# Altium schematic sheet 盲人学习机V6.01.SchDoc (part 1 of 2)
size A0
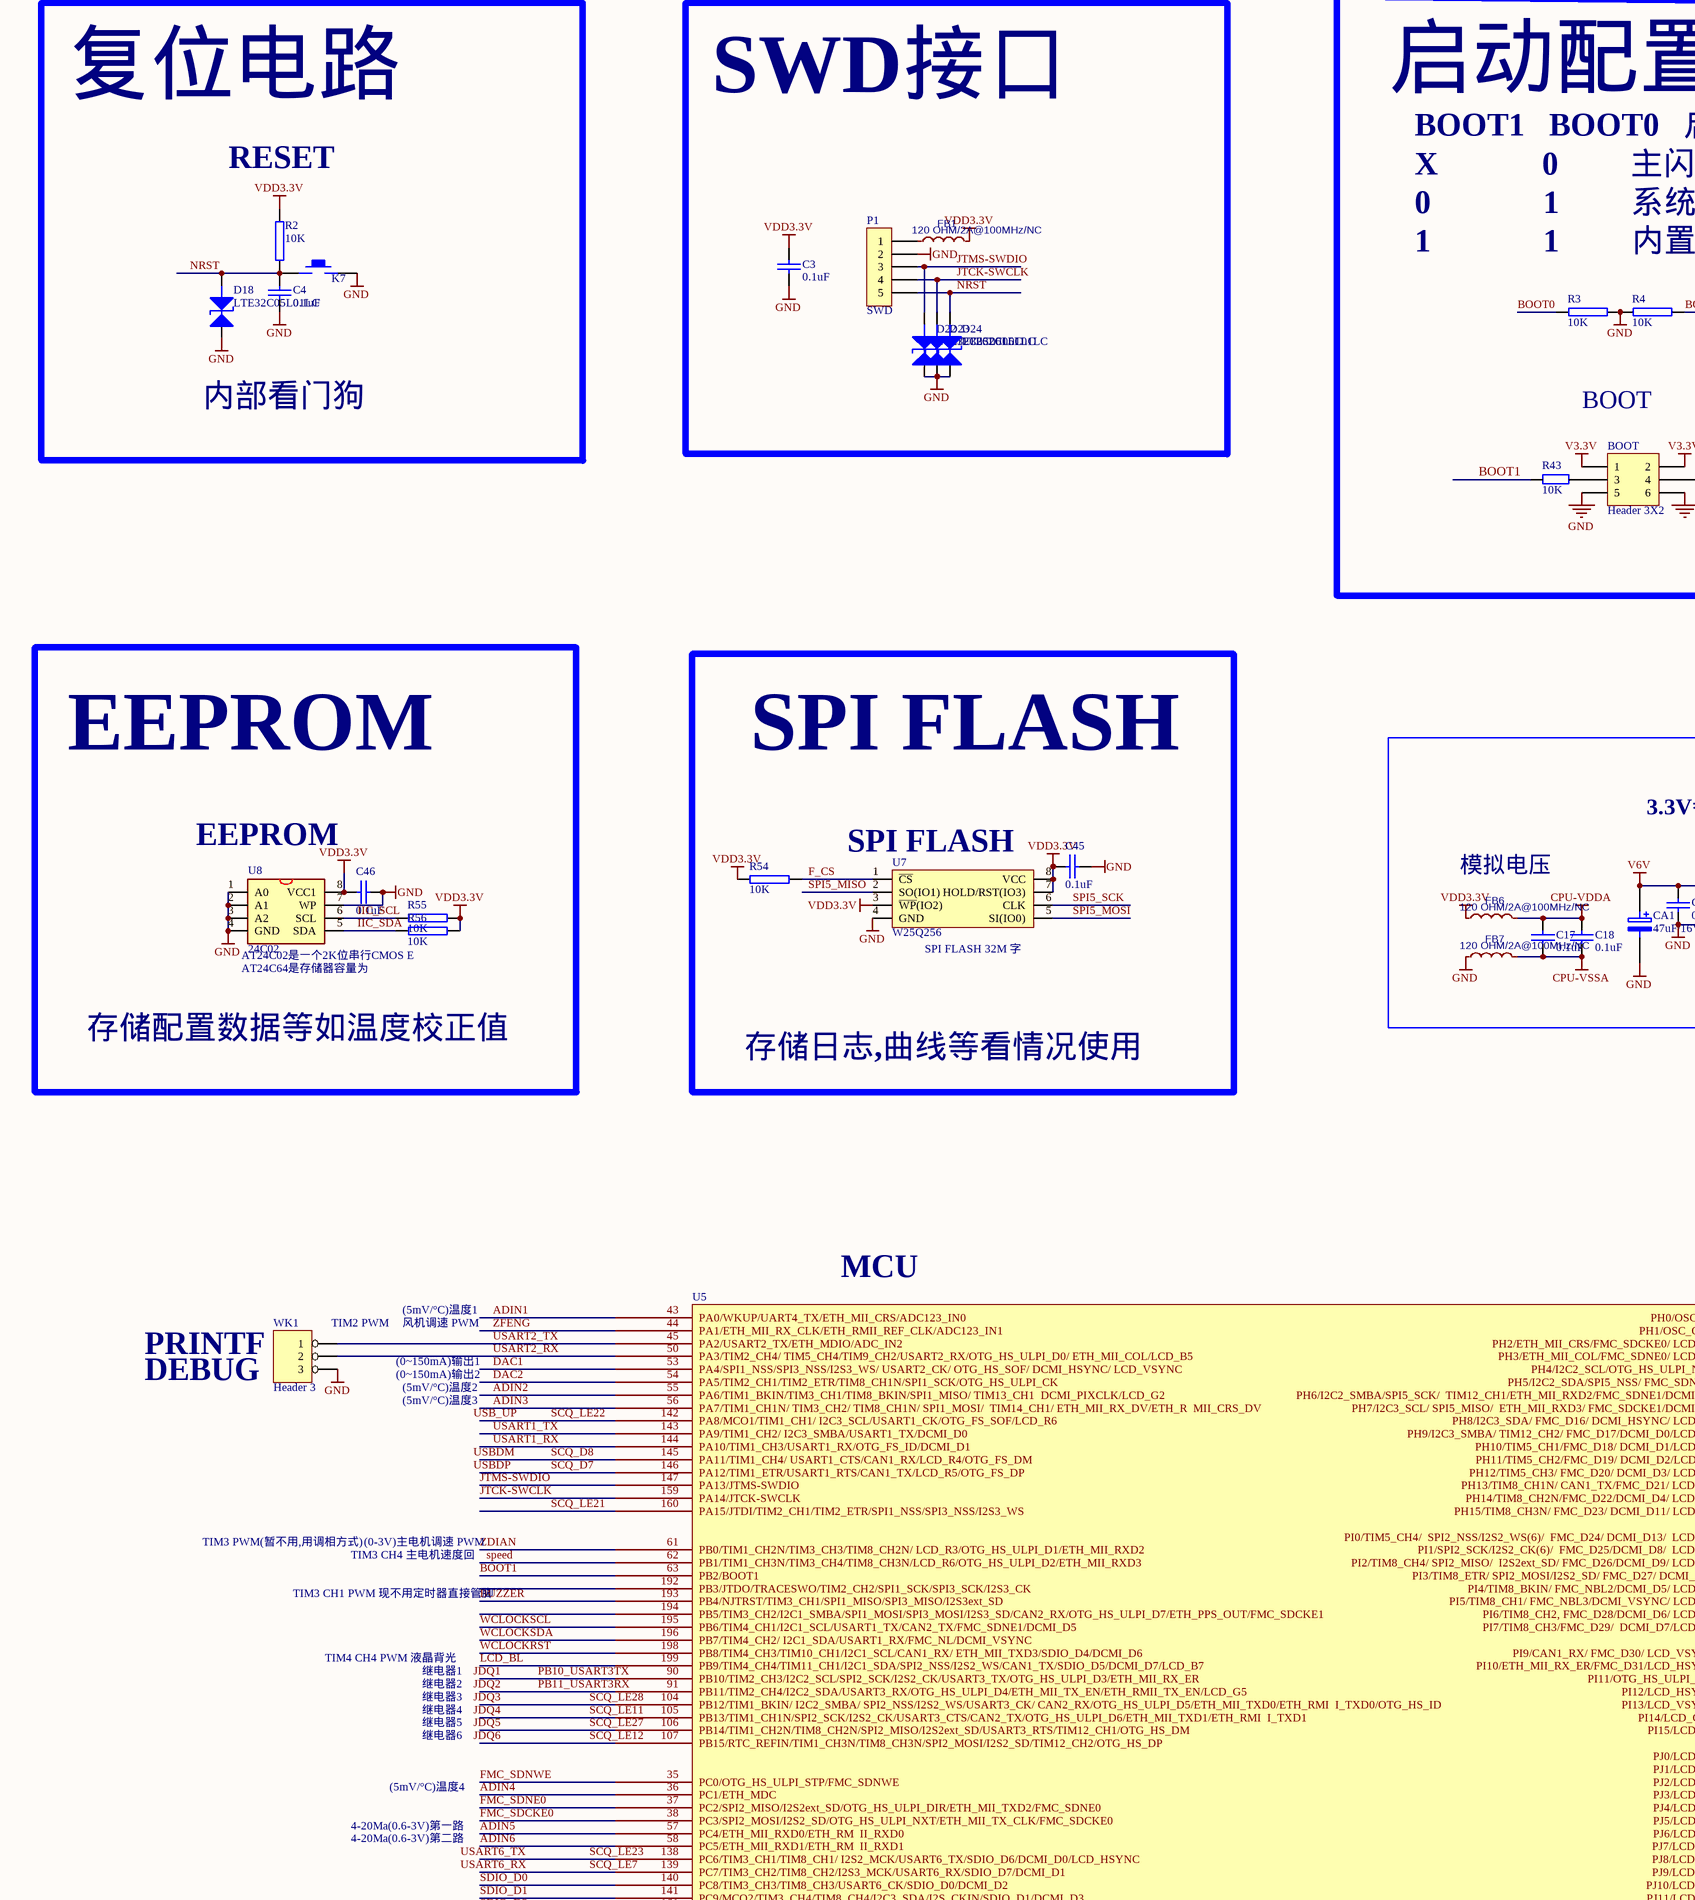
[diagram p0: 盲人学习机V6.01.SchDoc, top left]
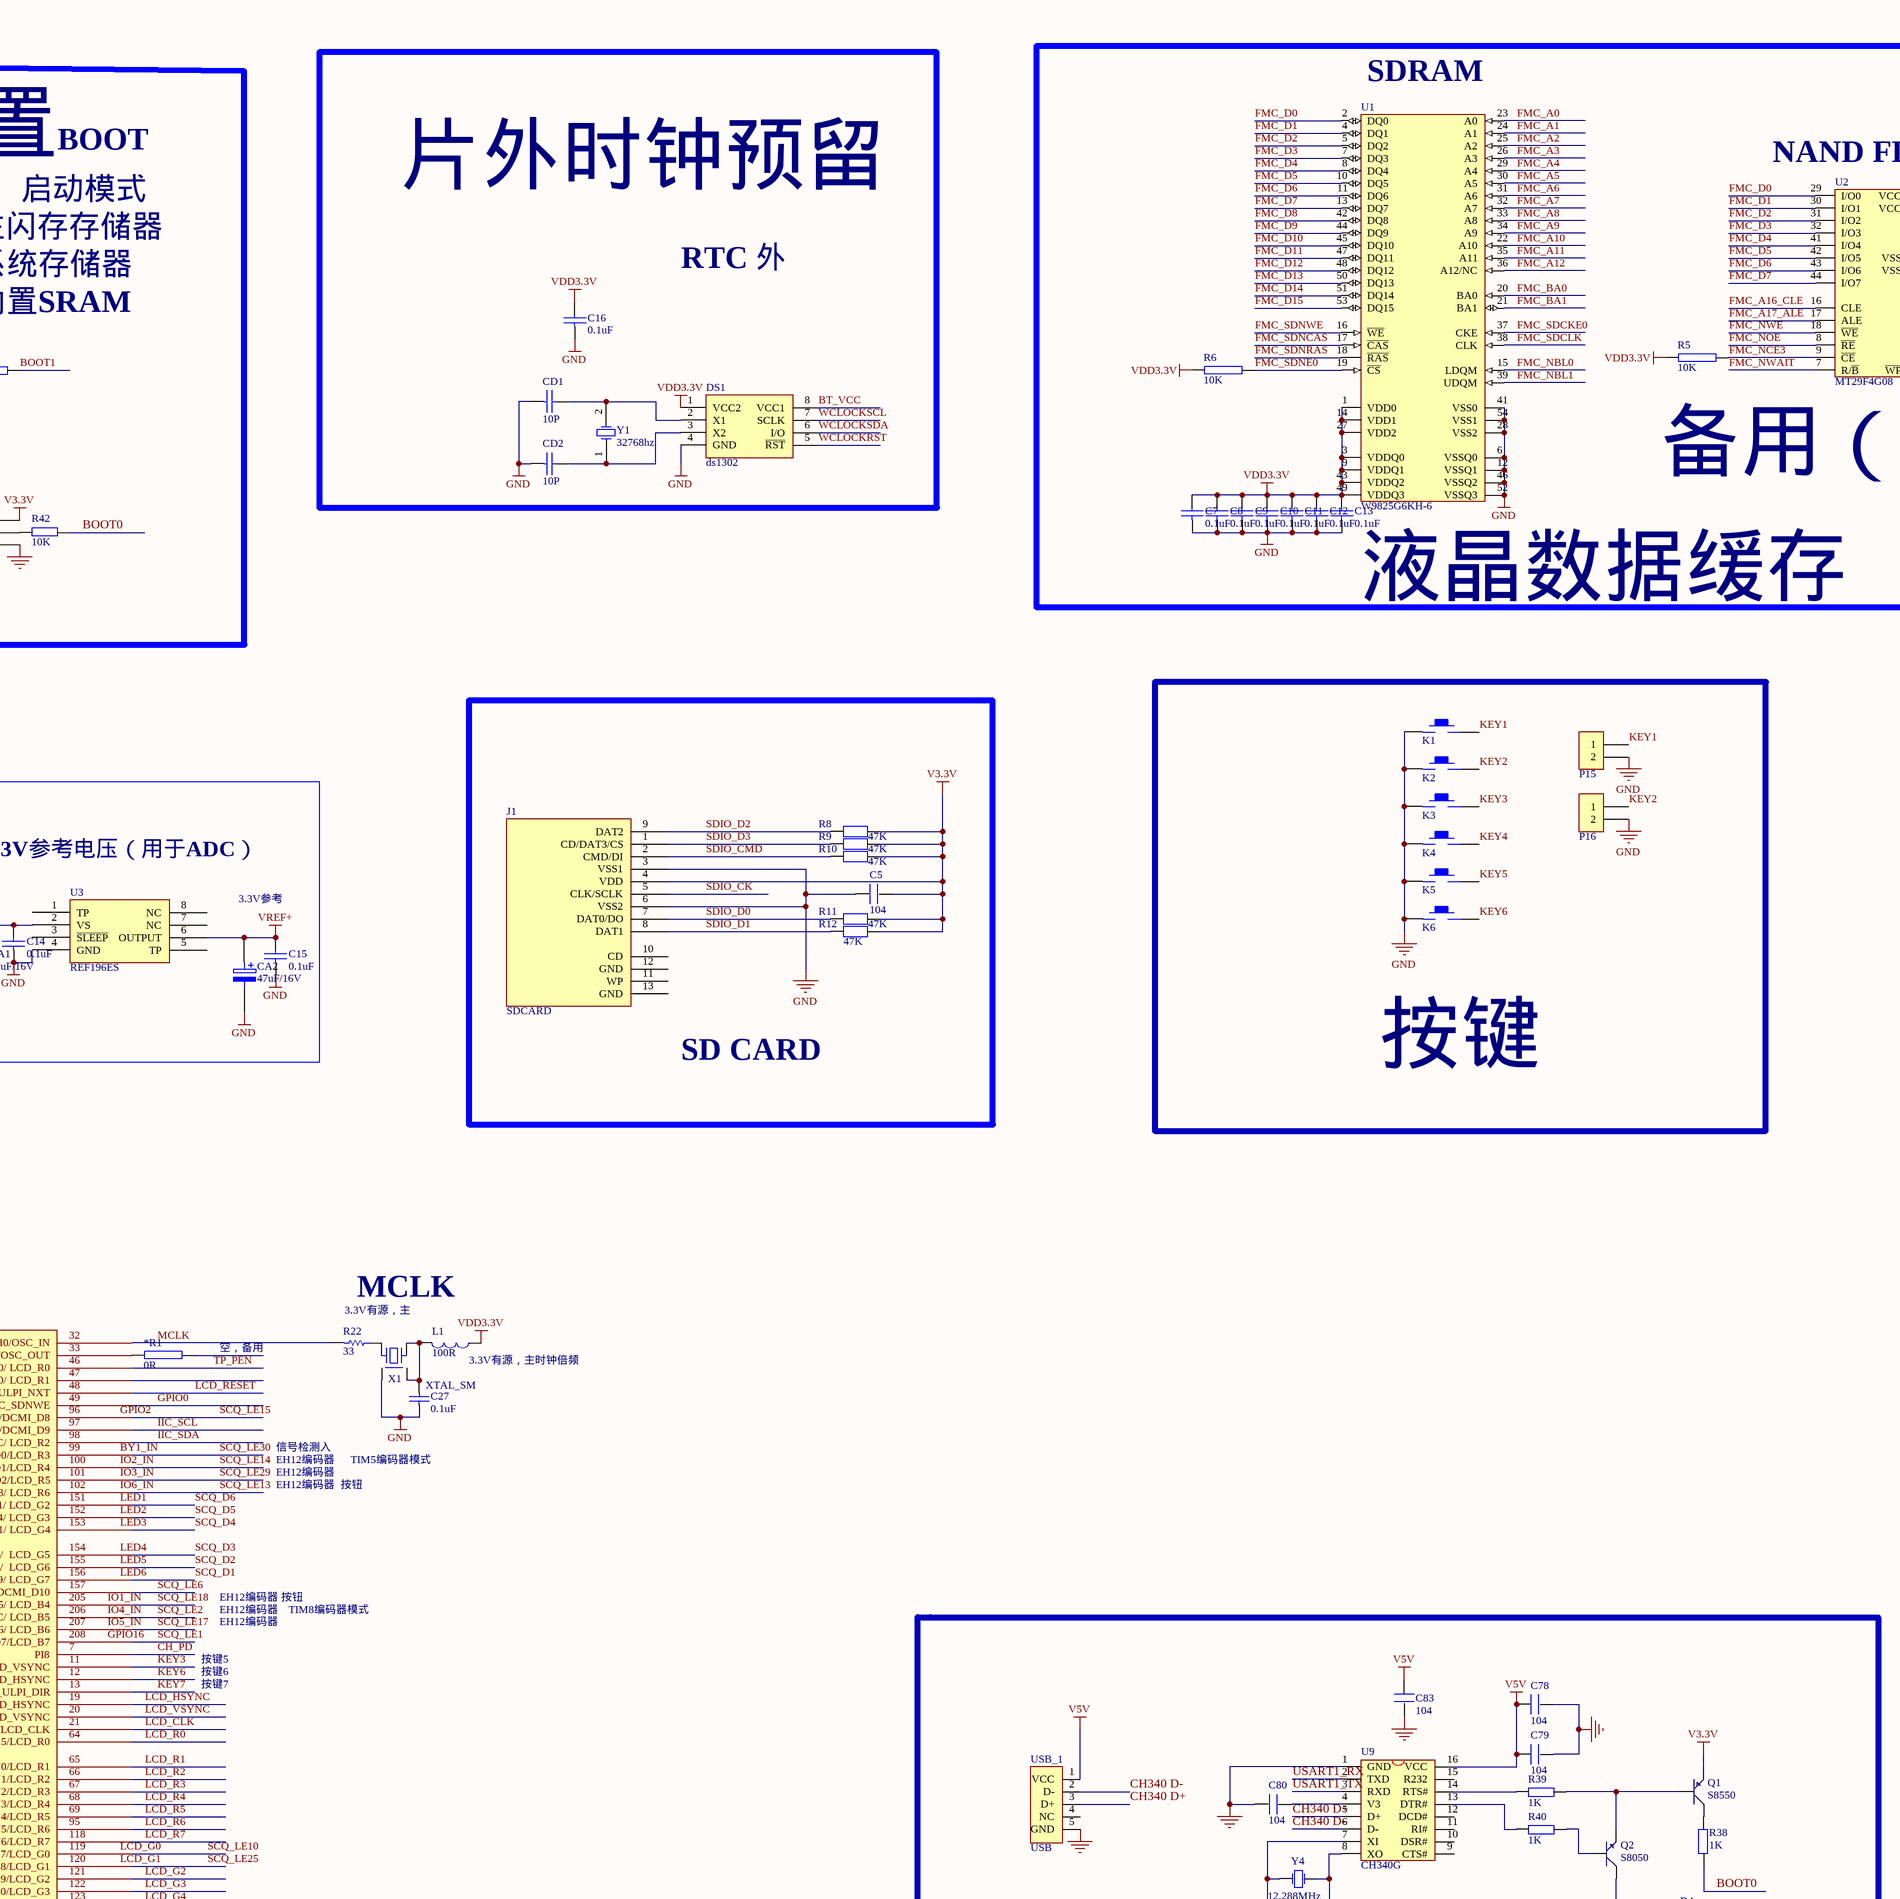
[diagram p1: 盲人学习机V6.01.SchDoc, top middle]
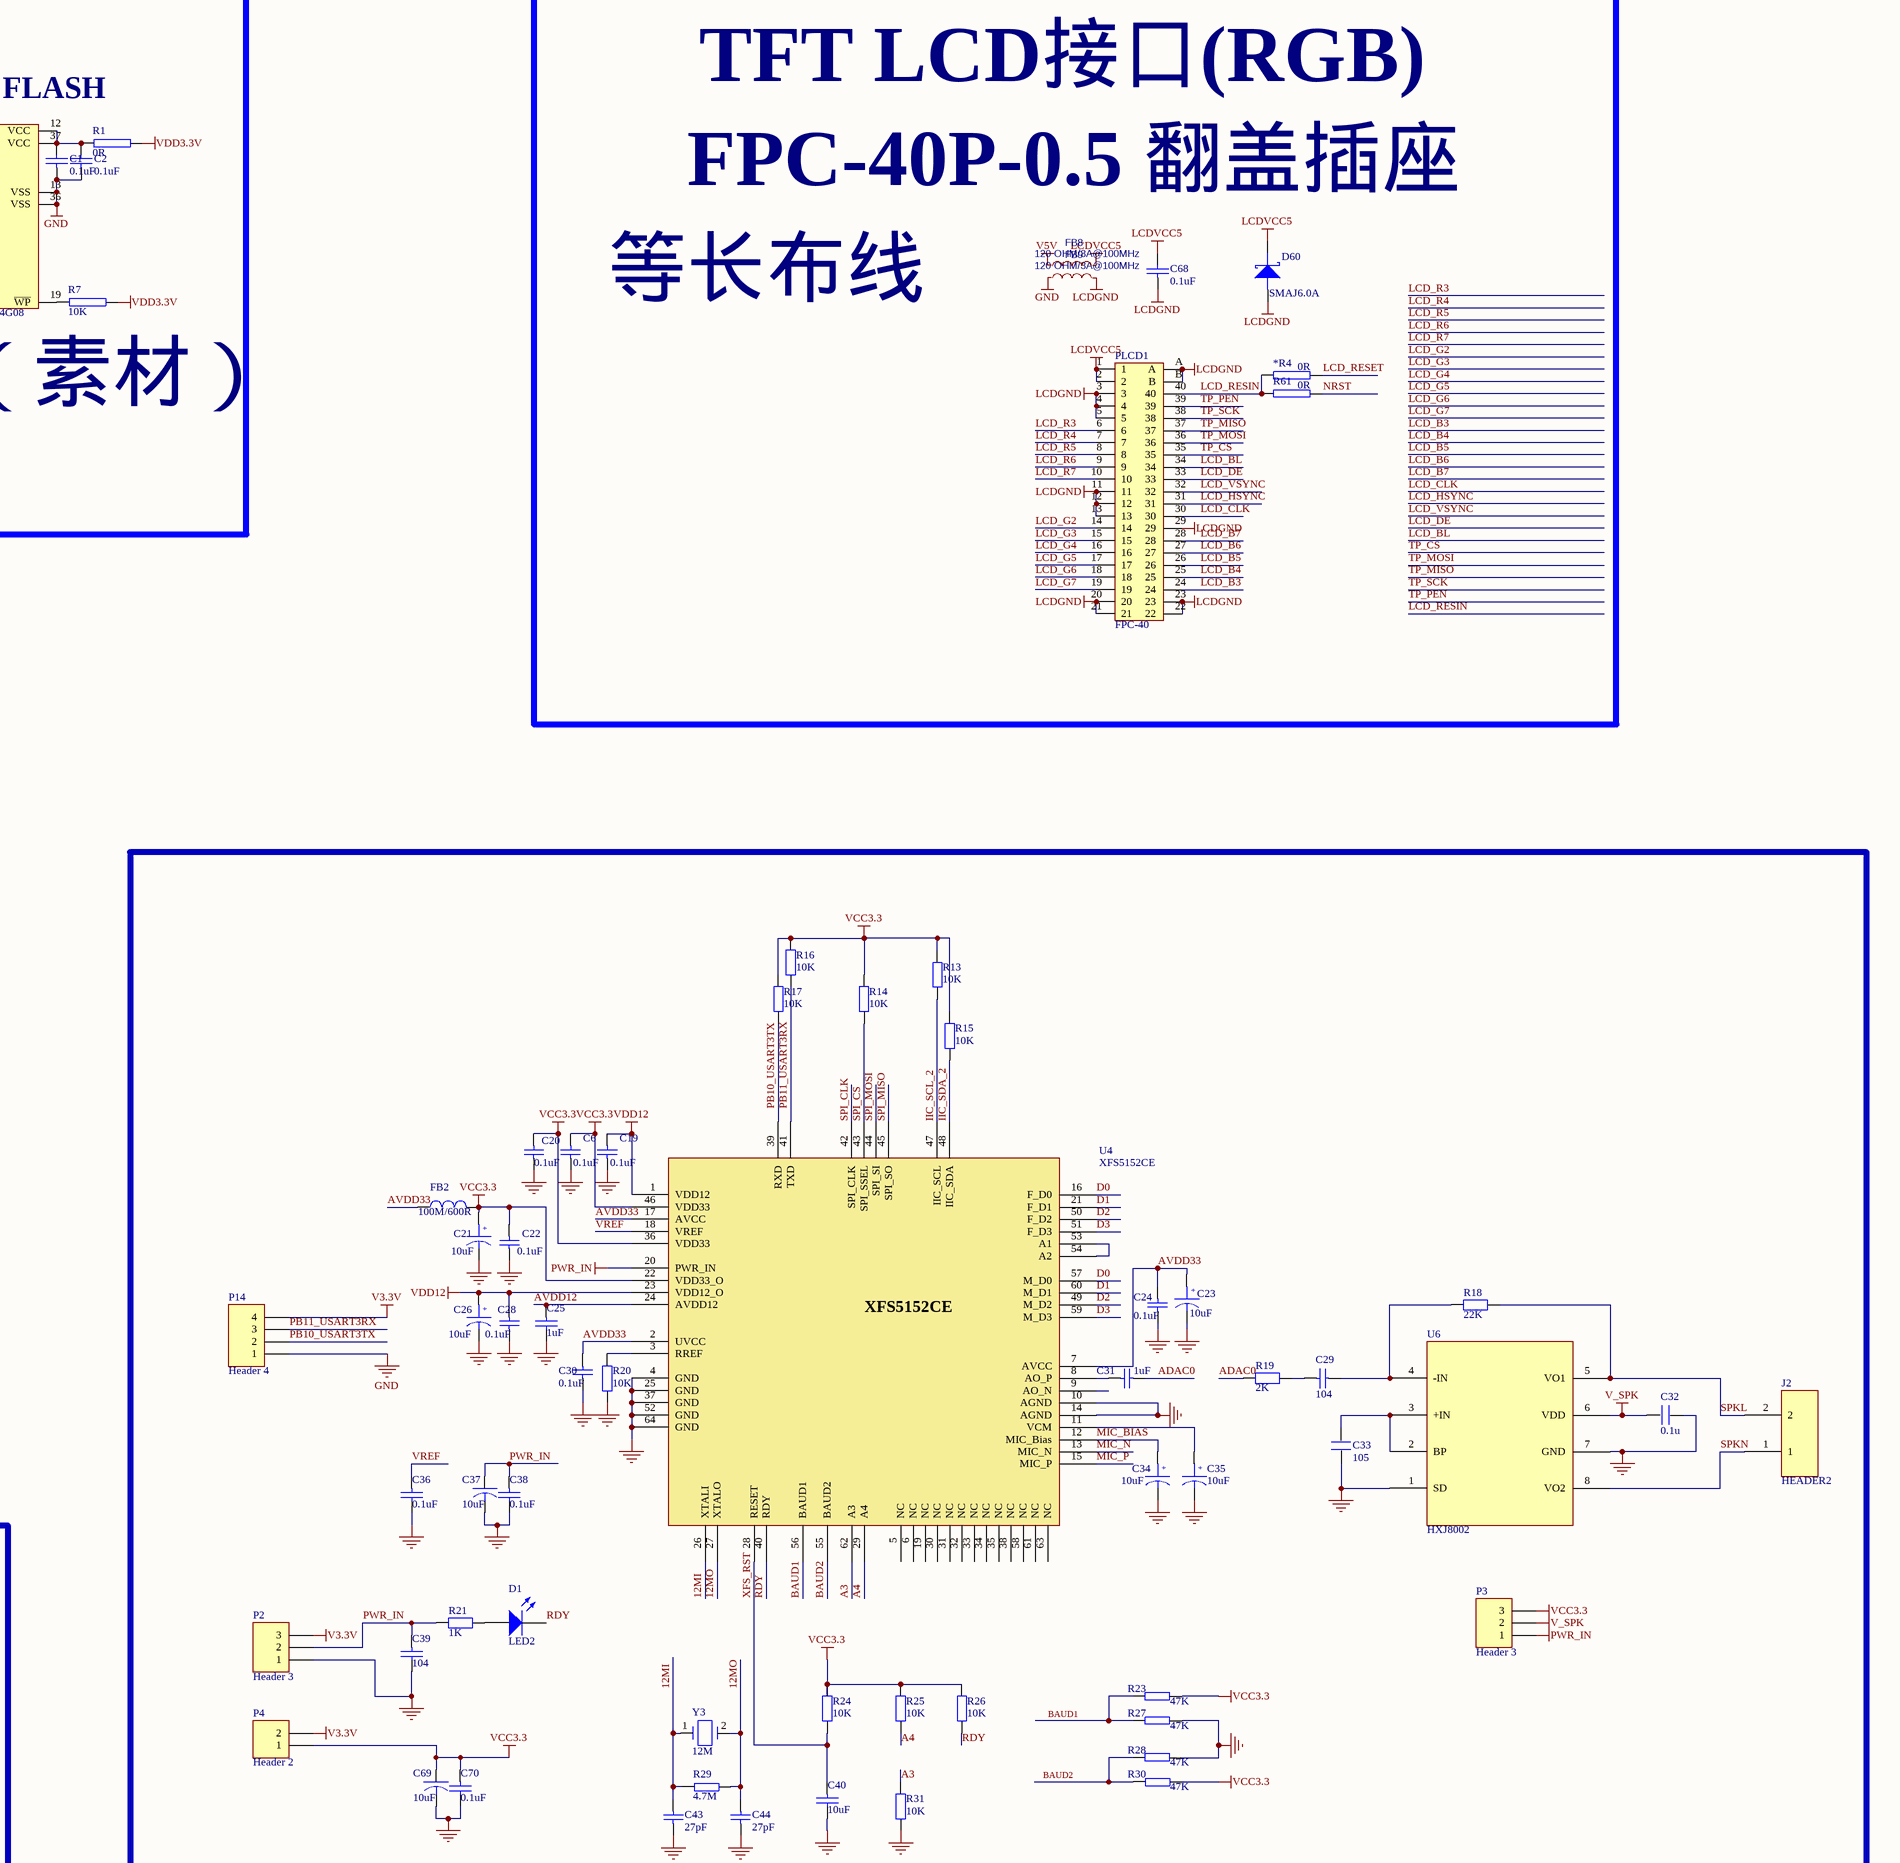
[diagram p2: 盲人学习机V6.01.SchDoc, top right]
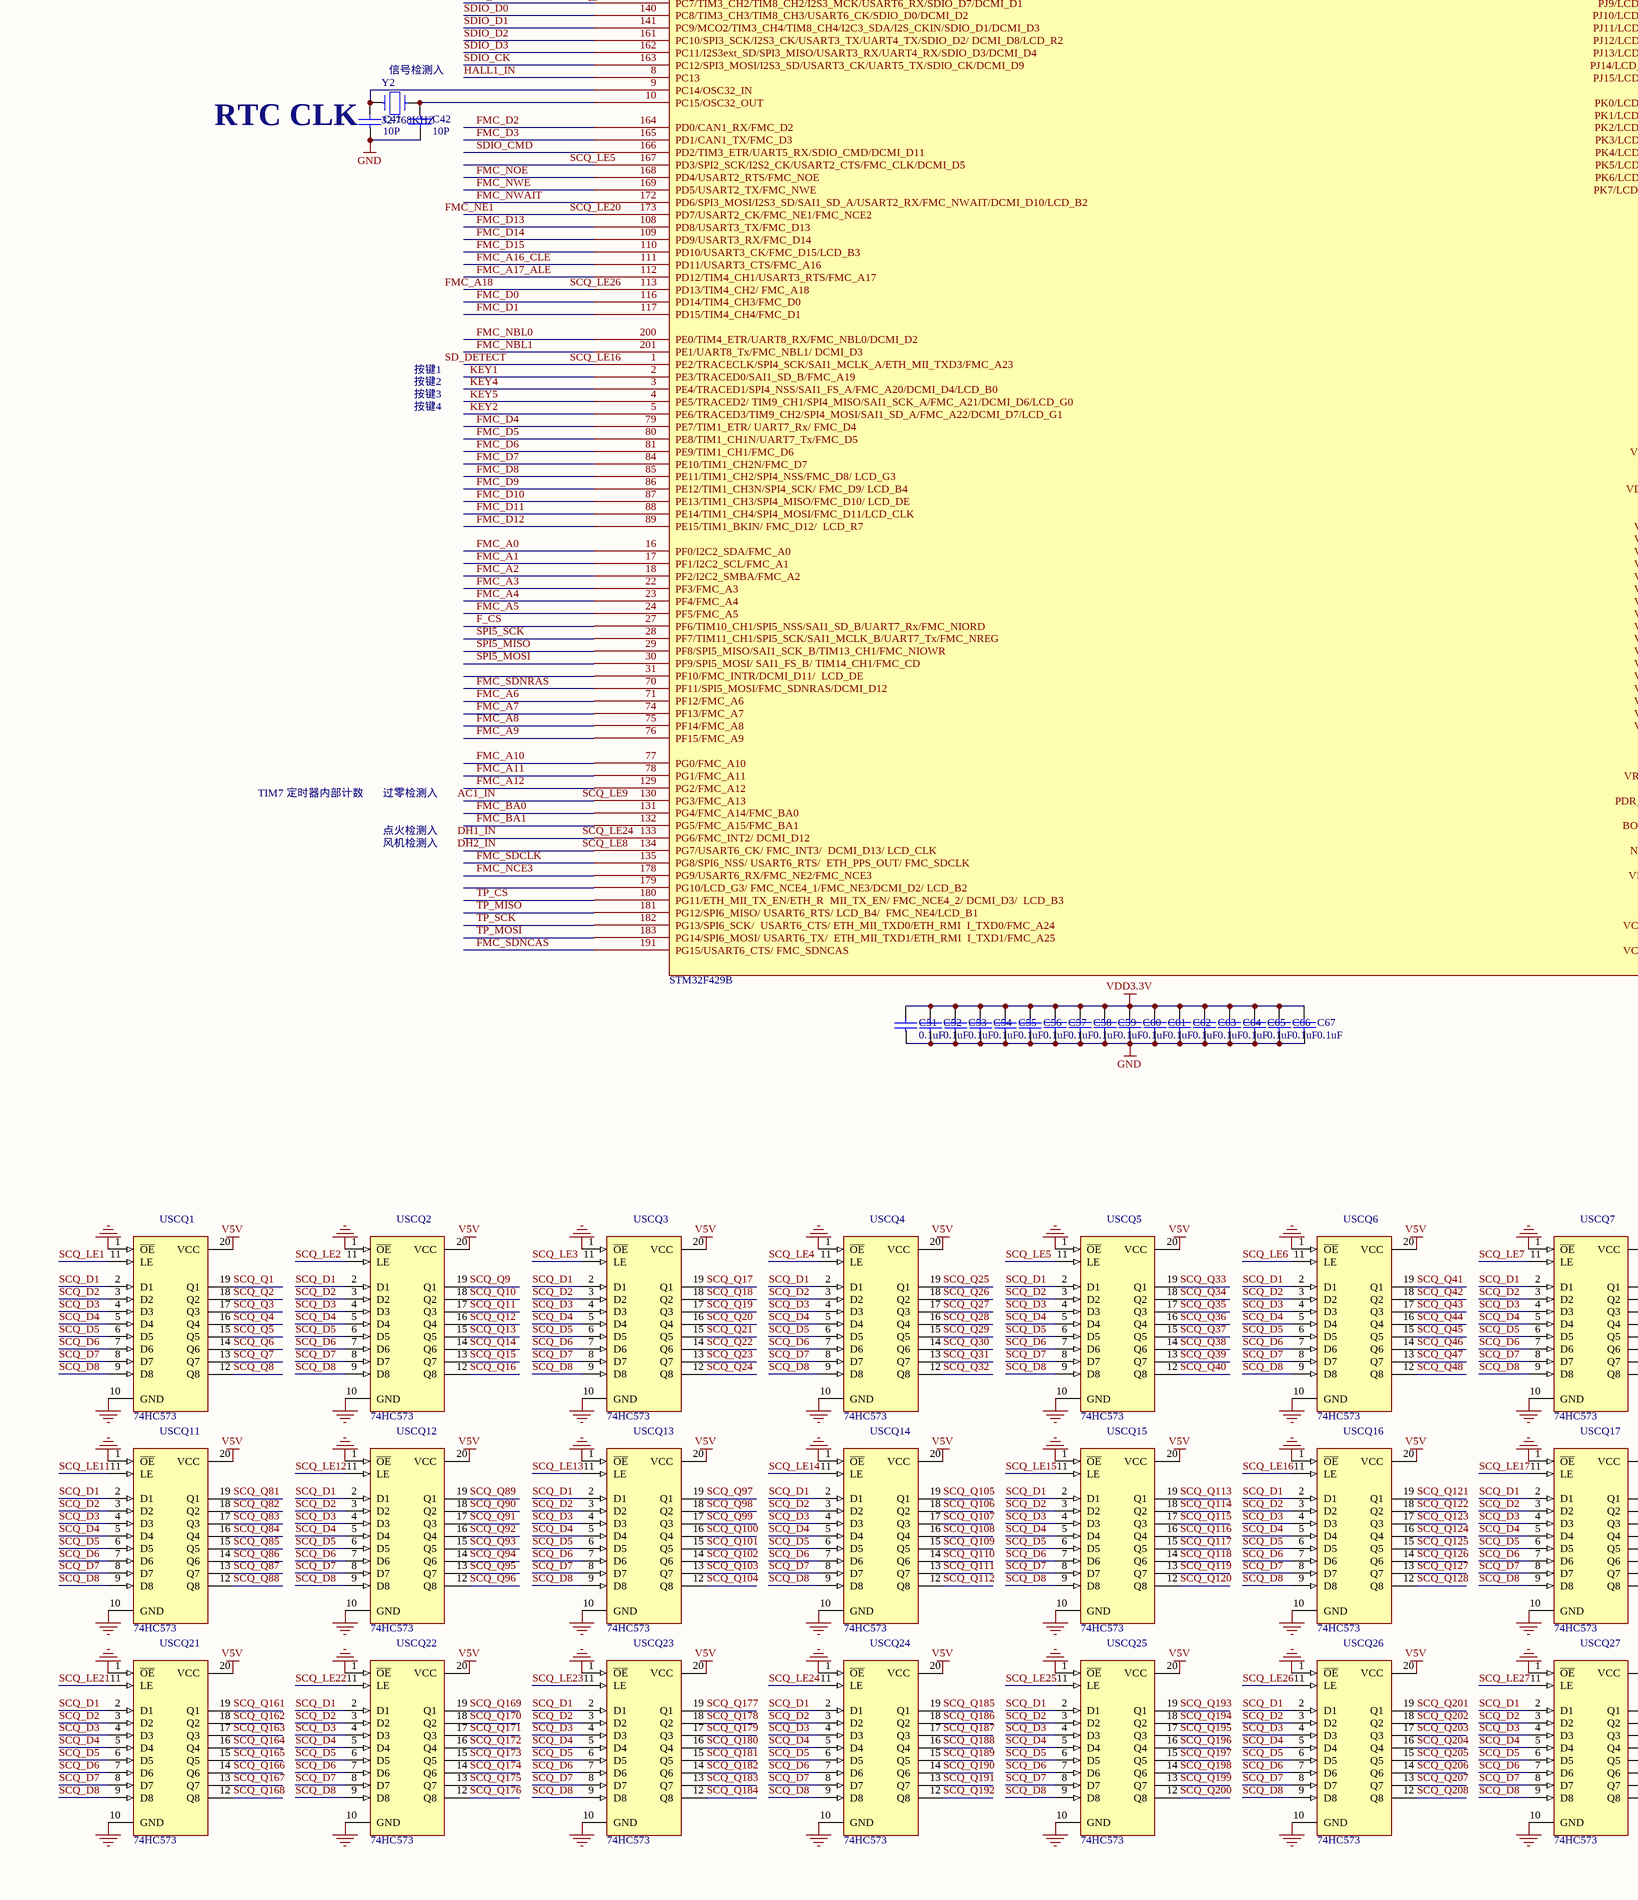
[diagram p3: 盲人学习机V6.01.SchDoc, bottom left]
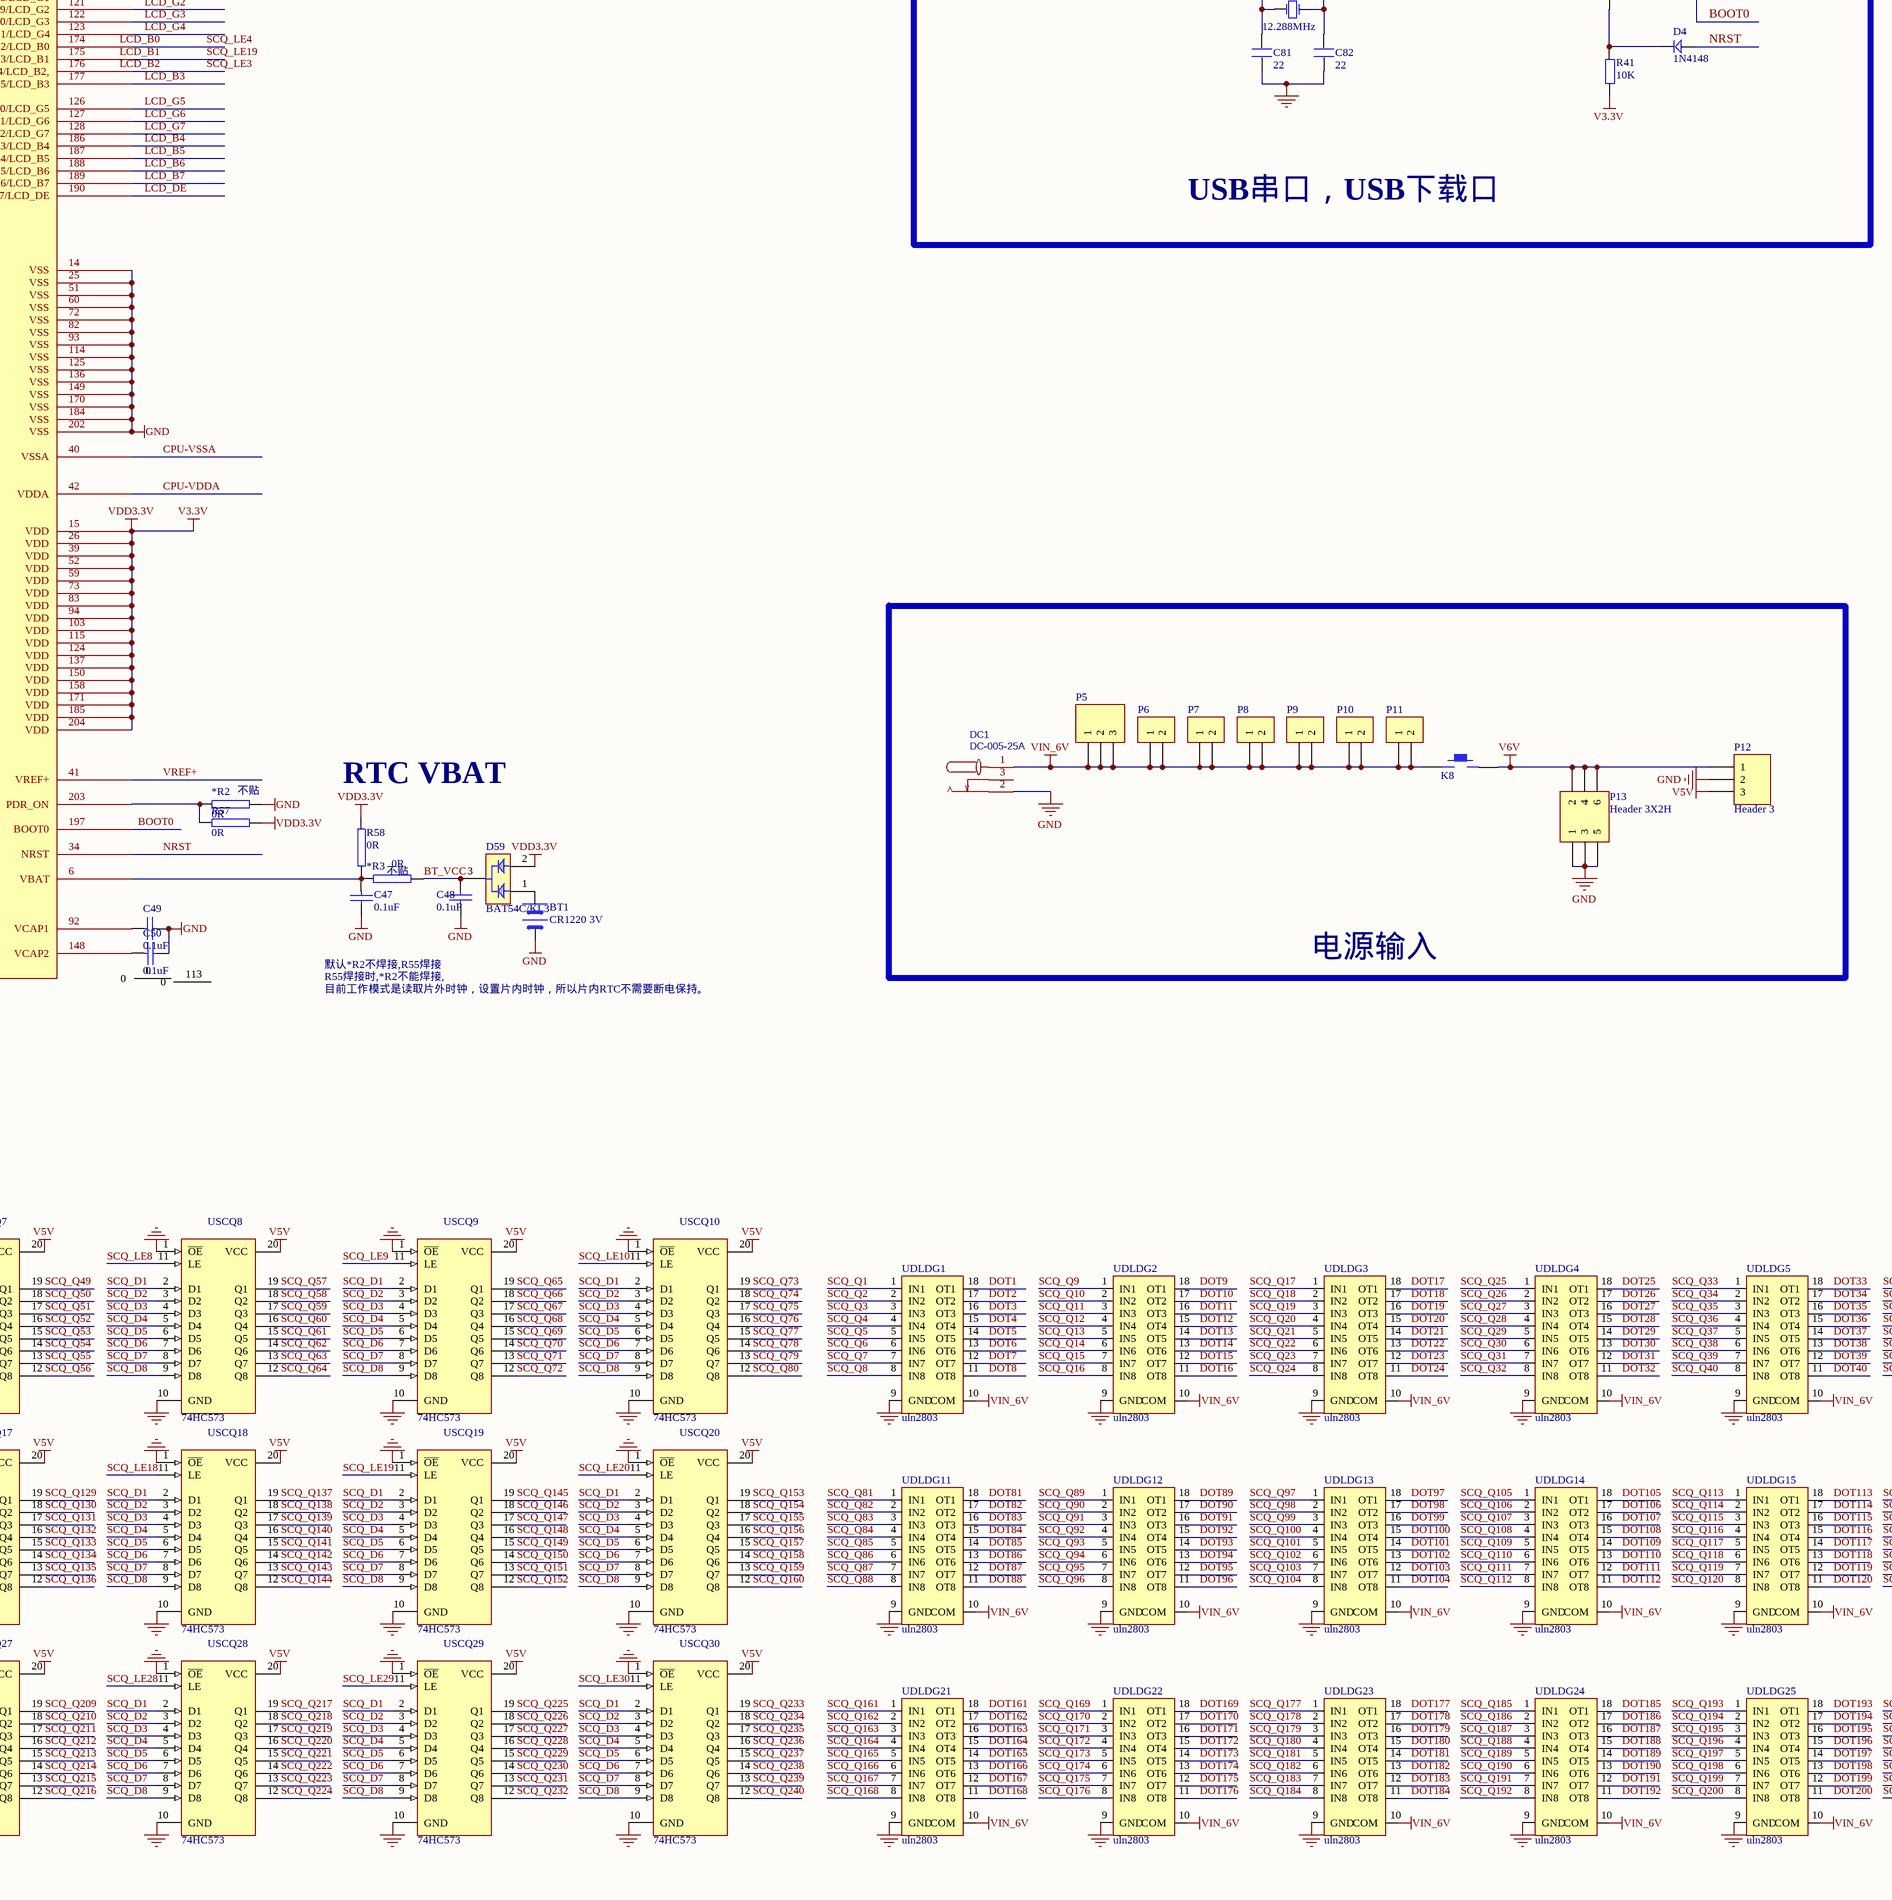
[diagram p4: 盲人学习机V6.01.SchDoc, bottom middle]
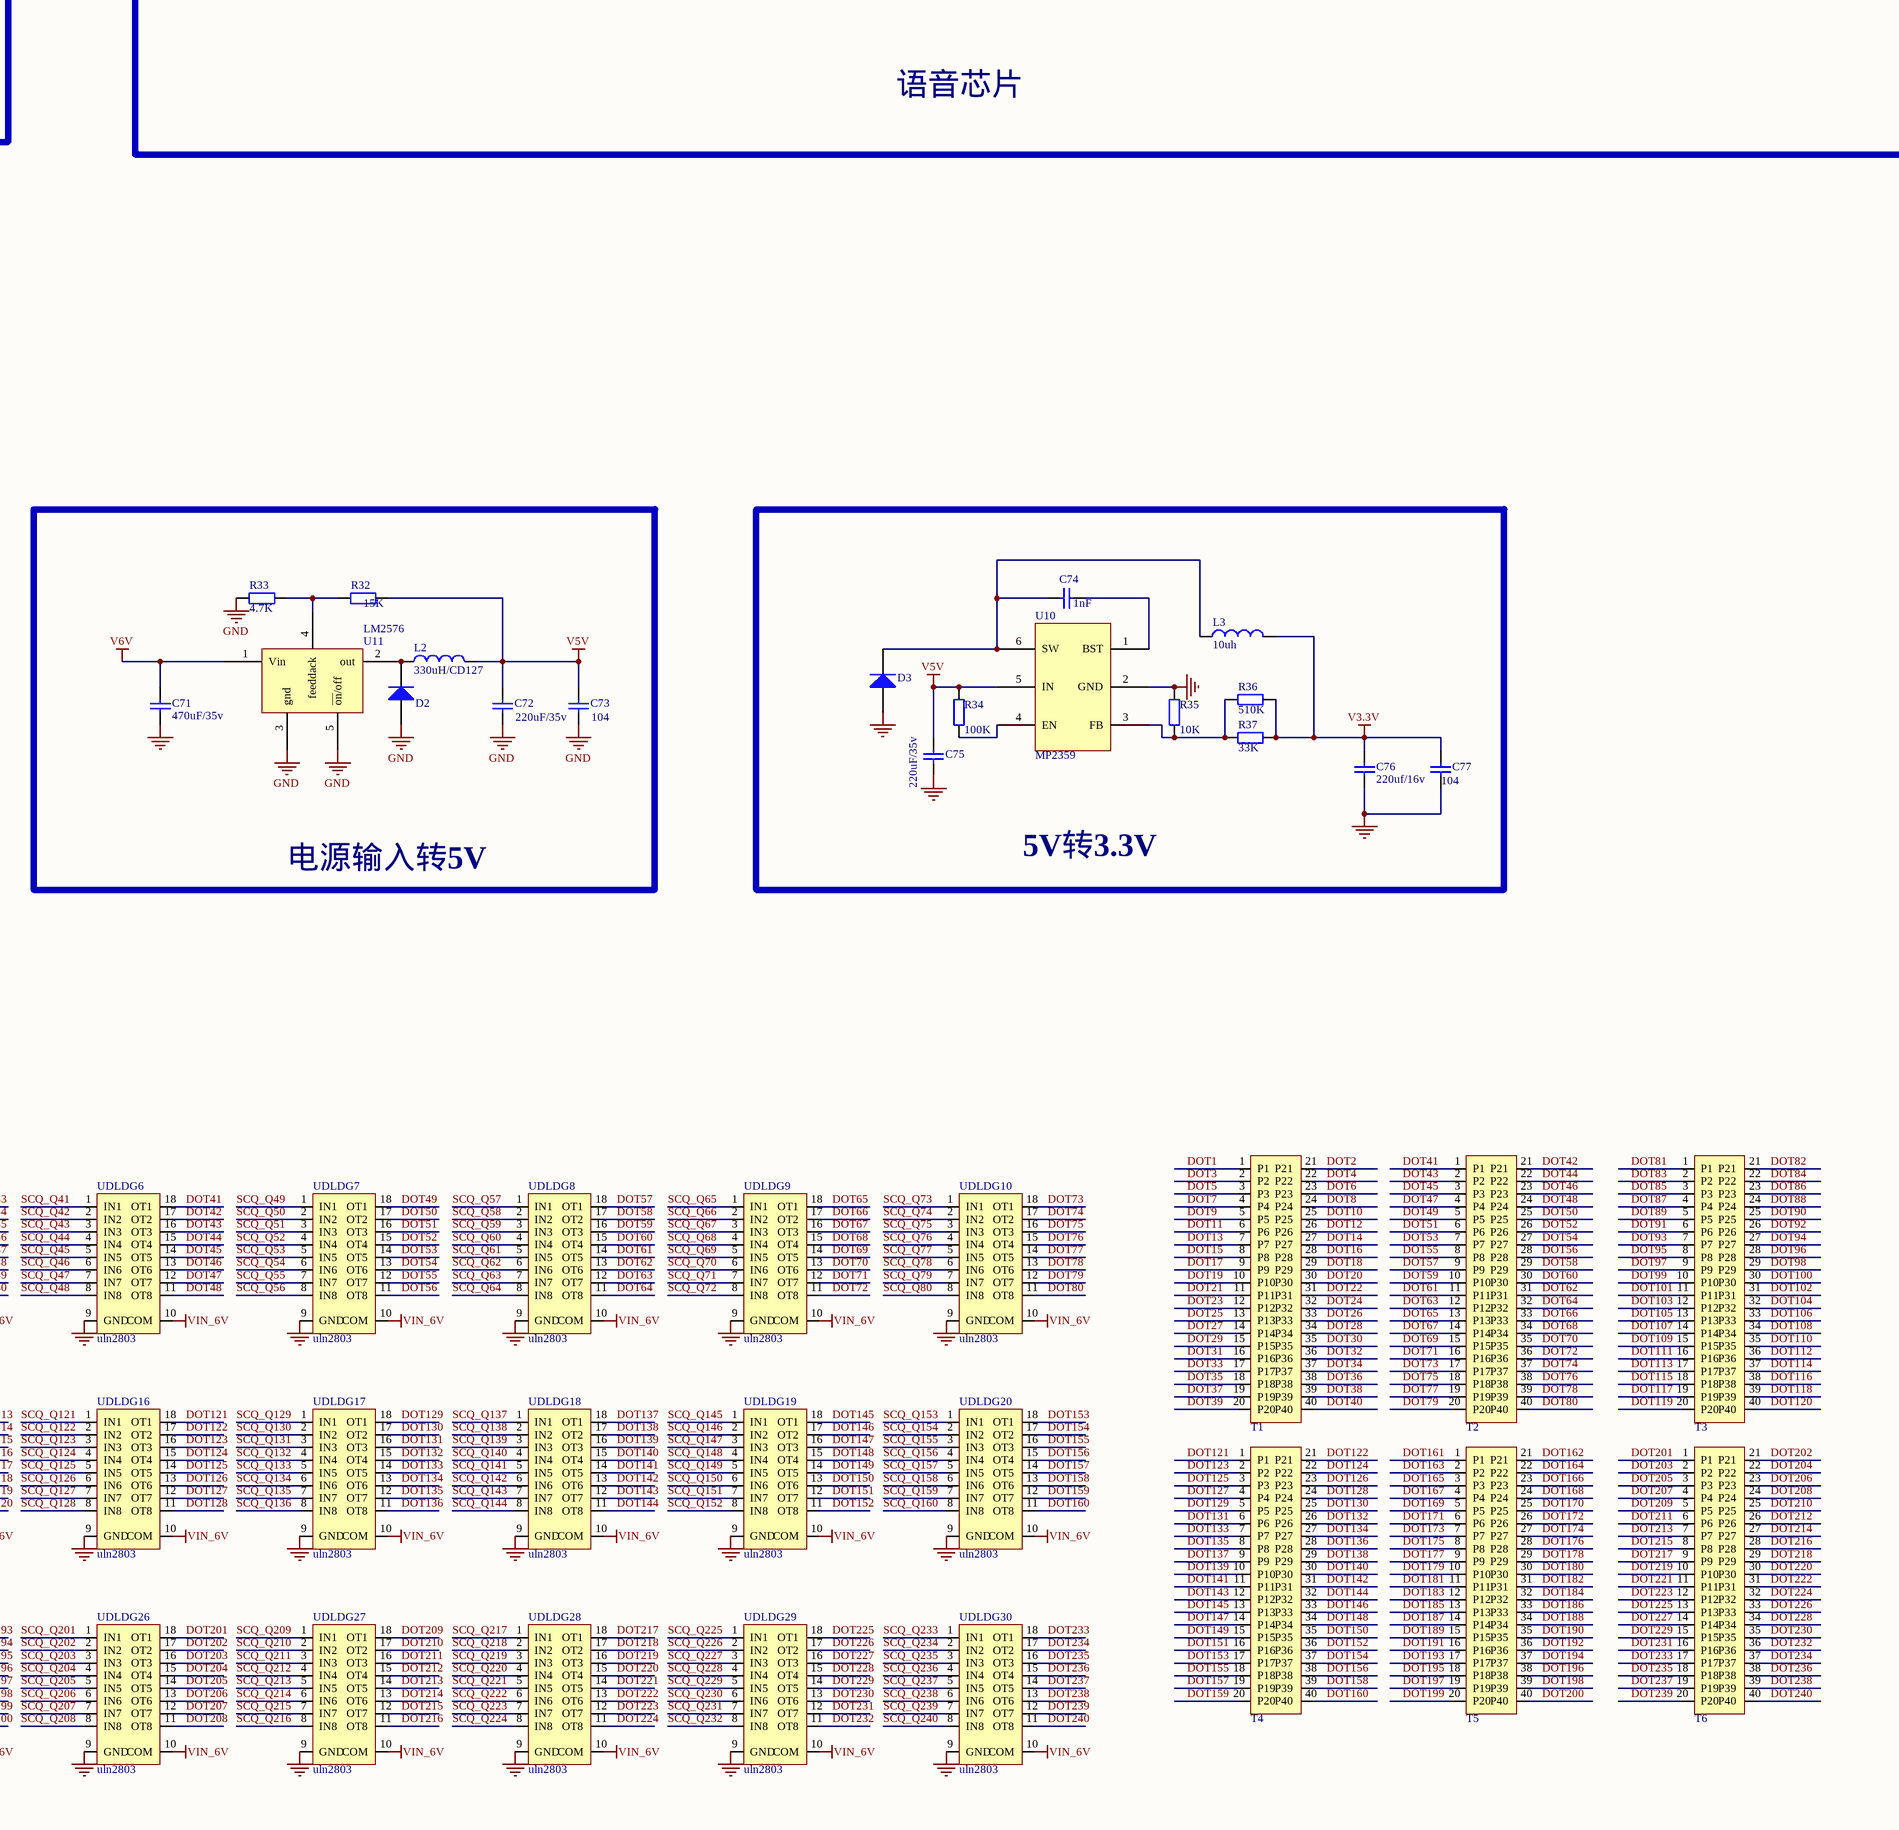
[diagram p5: 盲人学习机V6.01.SchDoc, bottom right]

## Parts
*R1  0R  [0603R]
*R2  0R  [0603R]
*R3  0R  [0603R]
*R4  0R  [0603R]
BOOT  Header 3X2  [HDR2X3]
BT1  CR1220 3V  [CR1220-1]
C1  0.1uF  [0603C]
C2  0.1uF  [0603C]
C3  0.1uF  [0603C]
C4  0.1uF  [0603C]
C5  104  [0603C]
C6  0.1uF  [0603C]
C7  0.1uF  [0603C]
C8  0.1uF  [0603C]
C9  0.1uF  [0603C]
C10  0.1uF  [0603C]
C11  0.1uF  [0603C]
C12  0.1uF  [0603C]
C13  0.1uF  [0603C]
C14  0.1uF  [0603C]
C15  0.1uF  [0603C]
C16  0.1uF  [0603C]
C17  0.1uF  [0603C]
C18  0.1uF  [0603C]
C19  0.1uF  [0603C]
C20  0.1uF  [0603C]
C21  10uF  [0805C]
C22  0.1uF  [0603C]
C23  10uF  [0805C]
C24  0.1uF  [0603C]
C25  1uF  [0603C]
C26  10uF  [0805C]
C27  value 0.1uF  [0603C]  (hidden comment: Cap S1)
C28  0.1uF  [0603C]
C29  104  [0603C]
C30  0.1uF  [0603C]
C31  1uF  [0603C]
C32  0.1u  [0603C]
C33  105  [0603C]
C34  10uF  [0805C]
C35  10uF  [0805C]
C36  0.1uF  [0603C]
C37  10uF  [0805C]
C38  0.1uF  [0603C]
C39  104  [0603C]
C40  10uF  [0603C]
C41  10P  [0603C]
C42  10P  [0603C]
C43  27pF  [0603C]
C44  27pF  [0603C]
C45  0.1uF  [0603C]
C46  0.1uF  [0603C]
C47  0.1uF  [0603C]
C48  0.1uF  [0603C]
C49  0.1uF  [0603C]
C50  0.1uF  [0603C]
C51  0.1uF  [0603C]
C52  0.1uF  [0603C]
C53  0.1uF  [0603C]
C54  0.1uF  [0603C]
C55  0.1uF  [0603C]
C56  0.1uF  [0603C]
C57  0.1uF  [0603C]
C58  0.1uF  [0603C]
C59  0.1uF  [0603C]
C60  0.1uF  [0603C]
C61  0.1uF  [0603C]
C62  0.1uF  [0603C]
C63  0.1uF  [0603C]
C64  0.1uF  [0603C]
C65  0.1uF  [0603C]
C66  0.1uF  [0603C]
C67  0.1uF  [0603C]
C68  0.1uF  [0603C]
C69  10uF  [0805C]
C70  0.1uF  [0603C]
C71  value 470uF/35v  [C-1010-S]
C72  value 220uF/35v  [C-0808-S]
C73  value 104  [0603C]
C74  value 1nF  [0603C]
C75  value 220uF/35v  [C-0808-S]
C76  value 220uf/16v  [C-0808-S]
C77  value 104  [0603C]
C78  104  [0603C]
C79  104  [0603C]
C80  104  [0603C]
C81  22  [0603C]
C82  22  [0603C]
C83  104  [0603C]
CA1  47uF/16V  [C1210]
CA2  47uF/16V  [C1210]
CD1  10P  [0603C]
CD2  10P  [0603C]
D1  LED2  [3.2X1.6X1.1]
D2  (no value)  [DO-214AA]
D3  (no value)  [1206D-N]
D4  1N4148  [DIODE_SOP]
D18  LTE32C05L01LC  [SOD-323]
D22  LTE32C05L01LC  [SOD-323]
D23  LTE32C05L01LC  [SOD-323]
D24  LTE32C05L01LC  [SOD-323]
D59  BAT54C/KL3  [SOT-23]
D60  SMAJ6.0A  [DO-214AB]
DC1  DC-005-25A  [DC10B]
DS1  ds1302  [SO-8N]
FB1  120 OHM/2A@100MHz/NC  [SL0603]
FB2  100M/600R  [0603R]
FB6  120 OHM/2A@100MHz/NC  [SL0603]
FB7  120 OHM/2A@100MHz/NC  [SL0603]
FB8  120 OHM/3A@100MHz  [SL0805]
FB9  120 OHM/3A@100MHz  [SL0805]
J1  SDCARD  [SDCARD_L]
J2  HEADER2  [HDR1X2]
K1  KEY_M  [KEY_M]  (value not drawn)
K2  KEY_M  [KEY_M]  (value not drawn)
K3  KEY_M  [KEY_M]  (value not drawn)
K4  KEY_M  [KEY_M]  (value not drawn)
K5  KEY_M  [KEY_M]  (value not drawn)
K6  KEY_M  [KEY_M]  (value not drawn)
K7  KEY_M  [KEY_M]  (value not drawn)
K8  KEY_M  [BTN8.5*8.5]  (value not drawn)
L1  100R  [0603R]
L2  L1: 330uH/CD127  [L1270]
L3  L1: 10uh  [L0630]
P1  SWD  [CON5_2.5_1]
P2  Header 3  [HDR1X3]
P3  Header 3  [HDR1X3]
P4  Header 2  [HDR1X2]
P5  Header 3  [HDR1X3]  (value not drawn)
P6  CON2  [N1A]  (value not drawn)
P7  CON2  [N1A]  (value not drawn)
P8  CON2  [N1A]  (value not drawn)
P9  CON2  [N1A]  (value not drawn)
P10  CON2  [N1A]  (value not drawn)
P11  CON2  [N1A]  (value not drawn)
P12  Header 3  [HDR1X3]
P13  Header 3X2H  [HDR2X3]
P14  Header 4  [Header 2.54X4]
P15  CON2  [HDR1X2]  (value not drawn)
P16  CON2  [HDR1X2]  (value not drawn)
PLCD1  FPC-40  [FPC-TOP40]
Q1  S8550  [SOT-23R]
Q2  S8050  [SOT-23R]
R1  0R  [0603R]
R2  10K  [0603R]
R3  10K  [0603R]
R4  10K  [0603R]
R5  10K  [0603R]
R6  10K  [0603R]
R7  10K  [0603R]
R8  value 47K  [0603R]  (hidden comment: Res1)
R9  value 47K  [0603R]  (hidden comment: Res1)
R10  value 47K  [0603R]  (hidden comment: Res1)
R11  value 47K  [0603R]  (hidden comment: Res1)
R12  value 47K  [0603R]  (hidden comment: Res1)
R13  10K  [R0603]
R14  10K  [R0603]
R15  10K  [R0603]
R16  10K  [R0603]
R17  10K  [R0603]
R18  22K  [R0603]
R19  value 2K  [R0603]  (hidden comment: 10K)
R20  10K  [R0603]
R21  value 1K  [R0603]  (hidden comment: 10K)
R22  value 33  [0603R]  (hidden comment: R1-S)
R23  47K  [R0603]
R24  10K  [R0603]
R25  10K  [R0603]
R26  10K  [R0603]
R27  47K  [R0603]
R28  47K  [R0603]
R29  4.7M  [R0603]
R30  47K  [R0603]
R31  10K  [R0603]
R32  value 15K  [0603R]
R33  value 4.7K  [0603R]
R34  value 100K  [0603R]
R35  value 10K  [0603R]
R36  value 510K  [0603R]
R37  value 33K  [0603R]
R38  1K  [0603R]
R39  1K  [0603R]
R40  1K  [0603R]
R41  10K  [0603R]
R42  10K  [0603R]
R43  10K  [0603R]
R54  10K  [0603R]
R55  10K  [0603R]
R56  10K  [0603R]
R57  0R  [0603R]
R58  0R  [0603R]
R61  0R  [0603R]
T1  dubangxian  [杜邦线插脚]  (value not drawn)
T2  dubangxian  [杜邦线插脚]  (value not drawn)
T3  dubangxian  [杜邦线插脚]  (value not drawn)
T4  dubangxian  [杜邦线插脚]  (value not drawn)
T5  dubangxian  [杜邦线插脚]  (value not drawn)
T6  dubangxian  [杜邦线插脚]  (value not drawn)
U1  W9825G6KH-6  [TSOP54]
U2  MT29F4G08  [TSOP48]
U3  REF196ES  [SO-8N]
U4  XFS5152CE  [LQFP64_N]
U5  STM32F429B  [STM32F429_LQFP208]
U6  HXJ8002  [SO-8]
U7  W25Q256  [SOP8-K]
U8  24C02  [SO-8N]
U9  CH340G  [SOP16M]
U10  MP2359  [SOT-26A]
U11  LM2576  [TO-263]
UDLDG1  uln2803  [sol-18]
UDLDG2  uln2803  [sol-18]
UDLDG3  uln2803  [sol-18]
UDLDG4  uln2803  [sol-18]
UDLDG5  uln2803  [sol-18]
UDLDG6  uln2803  [sol-18]
UDLDG7  uln2803  [sol-18]
UDLDG8  uln2803  [sol-18]
UDLDG9  uln2803  [sol-18]
UDLDG10  uln2803  [sol-18]
UDLDG11  uln2803  [sol-18]
UDLDG12  uln2803  [sol-18]
UDLDG13  uln2803  [sol-18]
UDLDG14  uln2803  [sol-18]
UDLDG15  uln2803  [sol-18]
UDLDG16  uln2803  [sol-18]
UDLDG17  uln2803  [sol-18]
UDLDG18  uln2803  [sol-18]
UDLDG19  uln2803  [sol-18]
UDLDG20  uln2803  [sol-18]
UDLDG21  uln2803  [sol-18]
UDLDG22  uln2803  [sol-18]
UDLDG23  uln2803  [sol-18]
UDLDG24  uln2803  [sol-18]
UDLDG25  uln2803  [sol-18]
UDLDG26  uln2803  [sol-18]
UDLDG27  uln2803  [sol-18]
UDLDG28  uln2803  [sol-18]
UDLDG29  uln2803  [sol-18]
UDLDG30  uln2803  [sol-18]
USB_1  USB  [USB/SM0.8-6H5]
USCQ1  74HC573  [SO20_M]
USCQ2  74HC573  [SO20_M]
USCQ3  74HC573  [SO20_M]
USCQ4  74HC573  [SO20_M]
USCQ5  74HC573  [SO20_M]
USCQ6  74HC573  [SO20_M]
USCQ7  74HC573  [SO20_M]
USCQ8  74HC573  [SO20_M]
USCQ9  74HC573  [SO20_M]
USCQ10  74HC573  [SO20_M]
USCQ11  74HC573  [SO20_M]
USCQ12  74HC573  [SO20_M]
USCQ13  74HC573  [SO20_M]
USCQ14  74HC573  [SO20_M]
USCQ15  74HC573  [SO20_M]
USCQ16  74HC573  [SO20_M]
USCQ17  74HC573  [SO20_M]
USCQ18  74HC573  [SO20_M]
USCQ19  74HC573  [SO20_M]
USCQ20  74HC573  [SO20_M]
USCQ21  74HC573  [SO20_M]
USCQ22  74HC573  [SO20_M]
USCQ23  74HC573  [SO20_M]
USCQ24  74HC573  [SO20_M]
USCQ25  74HC573  [SO20_M]
USCQ26  74HC573  [SO20_M]
USCQ27  74HC573  [SO20_M]
USCQ28  74HC573  [SO20_M]
USCQ29  74HC573  [SO20_M]
USCQ30  74HC573  [SO20_M]
WK1  Header 3  [CON-3-2.5]
X1  XTAL_SM  [X5032-1]
Y1  32768hz  [XTAL-3215]
Y2  32.768KHZ  [XTAL-3215]
Y3  12M  [XTAL_US]
Y4  12.288MHz  [XTAL_US]

## Blocks framed on the sheet
复位电路: C4 D18 K7 R2
SWD接口: C3 D22-D24 FB1 P1
启动配置: BOOT R3 R4 R42 R43
片外时钟预留: C16 CD1 CD2 DS1 Y1
备用（素材）: C1 C2 C7-C13 R1 R5-R7 U1 U2
按键: K1-K6 P15 P16
EEPROM: C46 R55 R56 U8
SPI FLASH: C45 R54 U7
SD CARD: C5 J1 R8-R12
语音芯片: C6 C19-C26 C28-C40 C43 C44 C69 C70 D1 FB2 J2 P2-P4 P14 R13-R21 R23-R31 U4 U6 Y3
电源输入: DC1 K8 P5-P13
电源输入转5V: C71-C73 D2 L2 R32 R33 U11
5V转3.3V: C74-C77 D3 L3 R34-R37 U10

## Nets
CPU-VDDA: C17.2 C18.2 FB6.2 U5.42(VDDA)
CPU-VSSA: C17.1 C18.1 FB7.2 U5.40(VSSA)
GND: *R2.1 BOOT.5 BOOT.6 BT1.2 C1.1 C2.1 C3.1 C4.1 C5.1 C6.1 C7.1 C8.1 C9.1 C10.1 C11.1 C12.1 C13.1 C14.1 C15.1 C16.1 C19.1 C20.1 C21.2 C22.1 C23.2 C24.1 C25.2 C26.2 C27.2 C28.1 C30.1 C32.1 C33.2 C34.2 C35.2 C36.2 C37.2 C38.2 C39.2 C40.2 C41.1 C42.2 C43.1 C44.1 C45.1 C46.1 C47.2 C48.1 C49.1 C50.2 C51.1 C52.1 C53.1 C54.1 C55.1 C56.1 C57.1 C58.1 C59.1 C60.1 C61.1 C62.1 C63.1 C64.1 C65.1 C66.1 C67.1 C69.2 C70.2 C71.1 C72.2 C73.2 C75.2 C76.1 C77.2 C78.2 C79.2 C80.1 C81.1 C82.1 C83.1 CA1.2 CA2.2 CD1.1 CD2.1 D2.1(A) D3.1(A) D18.2(K) D22.2(K) D23.2(K) D24.2(K) DC1.2 DS1.4(GND) FB7.1 FB9.1 J1.3(VSS1) J1.6(VSS2) K1.1 K2.1 K3.1 K4.1 K5.1 K6.1 K7.2 P1.2 P2.1 P12.2 P13.1 P13.3 P13.5 P14.1 P15.2 P16.2 R3.1 R4.1 R20.1 R27.1 R28.1 R31.1 R33.2 R35.2 U1.6(VSSQ0) U1.12(VSSQ1) U1.28(VSS2) U1.41(VSS0) U1.46(VSSQ2) U1.52(VSSQ3) U1.54(VSS1) U2.13(VSS) U2.36(VSS) U3.4(GND) U4.4(GND) U4.10(AGND) U4.14(AGND) U4.25(GND) U4.37(GND) U4.52(GND) U4.64(GND) U5.14(VSS) U5.25(VSS) U5.51(VSS) U5.60(VSS) U5.72(VSS) U5.82(VSS) U5.93(VSS) U5.114(VSS) U5.125(VSS) U5.136(VSS) U5.149(VSS) U5.170(VSS) U5.184(VSS) U5.202(VSS) U6.1(SD) U6.7(GND) U7.4(GND) U8.1(A0) U8.2(A1) U8.3(A2) U8.4(GND) U8.7(WP) U9.1(GND) U10.2(GND) U11.3(gnd) U11.5(~{on}/off) UDLDG1.9(GND) UDLDG2.9(GND) UDLDG3.9(GND) UDLDG4.9(GND) UDLDG5.9(GND) UDLDG6.9(GND) UDLDG7.9(GND) UDLDG8.9(GND) UDLDG9.9(GND) UDLDG10.9(GND) UDLDG11.9(GND) UDLDG12.9(GND) UDLDG13.9(GND) UDLDG14.9(GND) UDLDG15.9(GND) UDLDG16.9(GND) UDLDG17.9(GND) UDLDG18.9(GND) UDLDG19.9(GND) UDLDG20.9(GND) UDLDG21.9(GND) UDLDG22.9(GND) UDLDG23.9(GND) UDLDG24.9(GND) UDLDG25.9(GND) UDLDG26.9(GND) UDLDG27.9(GND) UDLDG28.9(GND) UDLDG29.9(GND) UDLDG30.9(GND) USB_1.5(GND) USCQ1.1(~{OE}) USCQ1.10(GND) USCQ2.1(~{OE}) USCQ2.10(GND) USCQ3.1(~{OE}) USCQ3.10(GND) USCQ4.1(~{OE}) USCQ4.10(GND) USCQ5.1(~{OE}) USCQ5.10(GND) USCQ6.1(~{OE}) USCQ6.10(GND) USCQ7.1(~{OE}) USCQ7.10(GND) USCQ8.1(~{OE}) USCQ8.10(GND) USCQ9.1(~{OE}) USCQ9.10(GND) USCQ10.1(~{OE}) USCQ10.10(GND) USCQ11.1(~{OE}) USCQ11.10(GND) USCQ12.1(~{OE}) USCQ12.10(GND) USCQ13.1(~{OE}) USCQ13.10(GND) USCQ14.1(~{OE}) USCQ14.10(GND) USCQ15.1(~{OE}) USCQ15.10(GND) USCQ16.1(~{OE}) USCQ16.10(GND) USCQ17.1(~{OE}) USCQ17.10(GND) USCQ18.1(~{OE}) USCQ18.10(GND) USCQ19.1(~{OE}) USCQ19.10(GND) USCQ20.1(~{OE}) USCQ20.10(GND) USCQ21.1(~{OE}) USCQ21.10(GND) USCQ22.1(~{OE}) USCQ22.10(GND) USCQ23.1(~{OE}) USCQ23.10(GND) USCQ24.1(~{OE}) USCQ24.10(GND) USCQ25.1(~{OE}) USCQ25.10(GND) USCQ26.1(~{OE}) USCQ26.10(GND) USCQ27.1(~{OE}) USCQ27.10(GND) USCQ28.1(~{OE}) USCQ28.10(GND) USCQ29.1(~{OE}) USCQ29.10(GND) USCQ30.1(~{OE}) USCQ30.10(GND) WK1.3 X1.2(GND)
LCDGND: C68.1 D60.1(A) FB9.2 PLCD1.3 PLCD1.4 PLCD1.5 PLCD1.11 PLCD1.12 PLCD1.13 PLCD1.20 PLCD1.21 PLCD1.22 PLCD1.23 PLCD1.29 PLCD1.A PLCD1.B
LCDVCC5: C68.2 D60.2(K) FB8.2 PLCD1.1 PLCD1.2
PWR_IN: C37.1 C38.1 C39.1 P2.2 P3.1 R21.2 U4.20(PWR_IN)
V3.3V: BOOT.1 BOOT.2 C3.2 C5.2 C7.2 C8.2 C9.2 C10.2 C11.2 C12.2 C13.2 C16.2 C45.2 C46.2 C51.2 C52.2 C53.2 C54.2 C55.2 C56.2 C57.2 C58.2 C59.2 C60.2 C61.2 C62.2 C63.2 C64.2 C65.2 C66.2 C67.2 C76.2 C77.1 D59.2 DS1.1(VCC2) FB1.2 FB6.1 J1.4(VDD) L1.1 L3.2 P2.3 P4.2 P14.4 Q1.1(E) R1.2 R2.1 R5.2 R6.2 R7.2 R8.2 R9.2 R10.2 R11.2 R12.2 R36.1 R37.1 R41.1 R54.1 R55.1 R56.1 R57.1 R58.1 U1.1(VDD0) U1.3(VDDQ0) U1.9(VDDQ1) U1.14(VDD1) U1.27(VDD2) U1.43(VDDQ2) U1.49(VDDQ3) U5.15(VDD) U5.26(VDD) U5.39(VDD) U5.52(VDD) U5.59(VDD) U5.73(VDD) U5.83(VDD) U5.94(VDD) U5.103(VDD) U5.115(VDD) U5.124(VDD) U5.137(VDD) U5.150(VDD) U5.158(VDD) U5.171(VDD) U5.185(VDD) U5.204(VDD) U7.3(~{WP}(IO2)) U7.7(HOLD/RST(IO3)) U7.8(VCC) U8.8(VCC1)  [also labelled VDD3.3V]
V5V: C72.1 C73.1 C75.1 C78.1 C79.1 C83.2 FB8.1 L2.1 P12.3 R32.2 R34.2 U9.16(VCC) U10.5(IN) USB_1.1(VCC) USCQ1.20(VCC) USCQ2.20(VCC) USCQ3.20(VCC) USCQ4.20(VCC) USCQ5.20(VCC) USCQ6.20(VCC) USCQ7.20(VCC) USCQ8.20(VCC) USCQ9.20(VCC) USCQ10.20(VCC) USCQ11.20(VCC) USCQ12.20(VCC) USCQ13.20(VCC) USCQ14.20(VCC) USCQ15.20(VCC) USCQ16.20(VCC) USCQ17.20(VCC) USCQ18.20(VCC) USCQ19.20(VCC) USCQ20.20(VCC) USCQ21.20(VCC) USCQ22.20(VCC) USCQ23.20(VCC) USCQ24.20(VCC) USCQ25.20(VCC) USCQ26.20(VCC) USCQ27.20(VCC) USCQ28.20(VCC) USCQ29.20(VCC) USCQ30.20(VCC)
V6V: C14.2 C71.2 CA1.1 K8.5 P12.1 P13.2 P13.4 P13.6 U3.2(VS) U11.1(Vin)
V_SPK: C32.2 P3.2 U6.6(VDD)
VCC3.3: C6.2 C20.2 C21.1 C22.2 C69.1 C70.1 FB2.2 P3.3 P4.1 R13.1 R14.1 R15.1 R16.1 R17.1 R23.1 R24.1 R25.1 R26.2 R30.2 U4.22(VDD33_O) U4.36(VDD33) U4.46(VDD33)
VDD12: C19.2 C26.1 C28.2 U4.1(VDD12) U4.23(VDD12_O)
VIN_6V: DC1.1 K8.6 P5.1 P5.2 P5.3 P6.1 P6.2 P7.1 P7.2 P8.1 P8.2 P9.1 P9.2 P10.1 P10.2 P11.1 P11.2 UDLDG1.10(COM) UDLDG2.10(COM) UDLDG3.10(COM) UDLDG4.10(COM) UDLDG5.10(COM) UDLDG6.10(COM) UDLDG7.10(COM) UDLDG8.10(COM) UDLDG9.10(COM) UDLDG10.10(COM) UDLDG11.10(COM) UDLDG12.10(COM) UDLDG13.10(COM) UDLDG14.10(COM) UDLDG15.10(COM) UDLDG16.10(COM) UDLDG17.10(COM) UDLDG18.10(COM) UDLDG19.10(COM) UDLDG20.10(COM) UDLDG21.10(COM) UDLDG22.10(COM) UDLDG23.10(COM) UDLDG24.10(COM) UDLDG25.10(COM) UDLDG26.10(COM) UDLDG27.10(COM) UDLDG28.10(COM) UDLDG29.10(COM) UDLDG30.10(COM)
VREF+: C15.2 CA2.1 U3.6(OUTPUT) U5.41(VREF+)
12MI: C43.2 R29.1 U4.26(XTALI) Y3.1
12MO: C44.2 R29.2 U4.27(XTALO) Y3.2
A3: R31.2 U4.62(A3)
A4: R25.2 U4.29(A4)
ADAC0: C31.1 R19.1
ADIN1: U5.43(PA0/WKUP/UART4_TX/ETH_MII_CRS/ADC123_IN0)
ADIN2: U5.55(PA6/TIM1_BKIN/TIM3_CH1/TIM8_BKIN/SPI1_MISO/_TIM13_CH1__DCMI_PIXCLK/LCD_G2)
ADIN3: U5.56(PA7/TIM1_CH1N/_TIM3_CH2/_TIM8_CH1N/_SPI1_MOSI/__TIM14_CH1/_ETH_MII_RX_DV/ETH_R__MII_CRS_DV)
ADIN4: U5.36(PC1/ETH_MDC)
ADIN5: U5.57(PC4/ETH_MII_RXD0/ETH_RM__II_RXD0)
ADIN6: U5.58(PC5/ETH_MII_RXD1/ETH_RM__II_RXD1)
AVDD12: C25.1 U4.24(AVDD12)
AVDD33: C23.1 C24.2 C30.2 FB2.1 U4.2(UVCC) U4.7(AVCC) U4.17(AVCC)
BAUD1: R23.2 R27.2 U4.56(BAUD1)
BAUD2: R28.2 R30.1 U4.55(BAUD2)
BOOT0: R3.2 R38.2 R42.1 U5.197(BOOT0)
BOOT1: R4.2 R43.2 U5.63(PB2/BOOT1)
BT_VCC: *R3.1 C48.2 D59.3 DS1.8(VCC1)
BUZZER: U5.193(PB4/NJTRST/TIM3_CH1/SPI1_MISO/SPI3_MISO/I2S3ext_SD)
CH340 D+: U9.5(D+) USB_1.3(D+)
CH340 D-: U9.6(D-) USB_1.2(D-)
CH_PD: U5.7(PI8)
D0: U4.16(F_D0) U4.57(M_D0)
D1: U4.21(F_D1) U4.60(M_D1)
D2: U4.49(M_D2) U4.50(F_D2)
D3: U4.51(F_D3) U4.59(M_D3)
DAC1: U5.53(PA4/SPI1_NSS/SPI3_NSS/I2S3_WS/_USART2_CK/_OTG_HS_SOF/_DCMI_HSYNC/_LCD_VSYNC)
DAC2: U5.54(PA5/TIM2_CH1/TIM2_ETR/TIM8_CH1N/SPI1_SCK/OTG_HS_ULPI_CK)
DOT1: T1.1(P1) UDLDG1.18(OT1)
DOT2: T1.21(P21) UDLDG1.17(OT2)
DOT3: T1.2(P2) UDLDG1.16(OT3)
DOT4: T1.22(P22) UDLDG1.15(OT4)
DOT5: T1.3(P3) UDLDG1.14(OT5)
DOT6: T1.23(P23) UDLDG1.13(OT6)
DOT7: T1.4(P4) UDLDG1.12(OT7)
DOT8: T1.24(P24) UDLDG1.11(OT8)
DOT9: T1.5(P5) UDLDG2.18(OT1)
DOT10: T1.25(P25) UDLDG2.17(OT2)
DOT11: T1.6(P6) UDLDG2.16(OT3)
DOT12: T1.26(P26) UDLDG2.15(OT4)
DOT13: T1.7(P7) UDLDG2.14(OT5)
DOT14: T1.27(P27) UDLDG2.13(OT6)
DOT15: T1.8(P8) UDLDG2.12(OT7)
DOT16: T1.28(P28) UDLDG2.11(OT8)
DOT17: T1.9(P9) UDLDG3.18(OT1)
DOT18: T1.29(P29) UDLDG3.17(OT2)
DOT19: T1.10(P10) UDLDG3.16(OT3)
DOT20: T1.30(P30) UDLDG3.15(OT4)
DOT21: T1.11(P11) UDLDG3.14(OT5)
DOT22: T1.31(P31) UDLDG3.13(OT6)
DOT23: T1.12(P12) UDLDG3.12(OT7)
DOT24: T1.32(P32) UDLDG3.11(OT8)
DOT25: T1.13(P13) UDLDG4.18(OT1)
DOT26: T1.33(P33) UDLDG4.17(OT2)
DOT27: T1.14(P14) UDLDG4.16(OT3)
DOT28: T1.34(P34) UDLDG4.15(OT4)
DOT29: T1.15(P15) UDLDG4.14(OT5)
DOT30: T1.35(P35) UDLDG4.13(OT6)
DOT31: T1.16(P16) UDLDG4.12(OT7)
DOT32: T1.36(P36) UDLDG4.11(OT8)
DOT33: T1.17(P17) UDLDG5.18(OT1)
DOT34: T1.37(P37) UDLDG5.17(OT2)
DOT35: T1.18(P18) UDLDG5.16(OT3)
DOT36: T1.38(P38) UDLDG5.15(OT4)
DOT37: T1.19(P19) UDLDG5.14(OT5)
DOT38: T1.39(P39) UDLDG5.13(OT6)
DOT39: T1.20(P20) UDLDG5.12(OT7)
DOT40: T1.40(P40) UDLDG5.11(OT8)
DOT41: T2.1(P1) UDLDG6.18(OT1)
DOT42: T2.21(P21) UDLDG6.17(OT2)
DOT43: T2.2(P2) UDLDG6.16(OT3)
DOT44: T2.22(P22) UDLDG6.15(OT4)
DOT45: T2.3(P3) UDLDG6.14(OT5)
DOT46: T2.23(P23) UDLDG6.13(OT6)
DOT47: T2.4(P4) UDLDG6.12(OT7)
DOT48: T2.24(P24) UDLDG6.11(OT8)
DOT49: T2.5(P5) UDLDG7.18(OT1)
DOT50: T2.25(P25) UDLDG7.17(OT2)
DOT51: T2.6(P6) UDLDG7.16(OT3)
DOT52: T2.26(P26) UDLDG7.15(OT4)
DOT53: T2.7(P7) UDLDG7.14(OT5)
DOT54: T2.27(P27) UDLDG7.13(OT6)
DOT55: T2.8(P8) UDLDG7.12(OT7)
DOT56: T2.28(P28) UDLDG7.11(OT8)
DOT57: T2.9(P9) UDLDG8.18(OT1)
DOT58: T2.29(P29) UDLDG8.17(OT2)
DOT59: T2.10(P10) UDLDG8.16(OT3)
DOT60: T2.30(P30) UDLDG8.15(OT4)
DOT61: T2.11(P11) UDLDG8.14(OT5)
DOT62: T2.31(P31) UDLDG8.13(OT6)
DOT63: T2.12(P12) UDLDG8.12(OT7)
DOT64: T2.32(P32) UDLDG8.11(OT8)
DOT65: T2.13(P13) UDLDG9.18(OT1)
DOT66: T2.33(P33) UDLDG9.17(OT2)
DOT67: T2.14(P14) UDLDG9.16(OT3)
DOT68: T2.34(P34) UDLDG9.15(OT4)
DOT69: T2.15(P15) UDLDG9.14(OT5)
DOT70: T2.35(P35) UDLDG9.13(OT6)
DOT71: T2.16(P16) UDLDG9.12(OT7)
DOT72: T2.36(P36) UDLDG9.11(OT8)
DOT73: T2.17(P17) UDLDG10.18(OT1)
DOT74: T2.37(P37) UDLDG10.17(OT2)
DOT75: T2.18(P18) UDLDG10.16(OT3)
DOT76: T2.38(P38) UDLDG10.15(OT4)
DOT77: T2.19(P19) UDLDG10.14(OT5)
DOT78: T2.39(P39) UDLDG10.13(OT6)
DOT79: T2.20(P20) UDLDG10.12(OT7)
DOT80: T2.40(P40) UDLDG10.11(OT8)
DOT81: T3.1(P1) UDLDG11.18(OT1)
DOT82: T3.21(P21) UDLDG11.17(OT2)
DOT83: T3.2(P2) UDLDG11.16(OT3)
DOT84: T3.22(P22) UDLDG11.15(OT4)
DOT85: T3.3(P3) UDLDG11.14(OT5)
DOT86: T3.23(P23) UDLDG11.13(OT6)
DOT87: T3.4(P4) UDLDG11.12(OT7)
DOT88: T3.24(P24) UDLDG11.11(OT8)
DOT89: T3.5(P5) UDLDG12.18(OT1)
DOT90: T3.25(P25) UDLDG12.17(OT2)
DOT91: T3.6(P6) UDLDG12.16(OT3)
DOT92: T3.26(P26) UDLDG12.15(OT4)
DOT93: T3.7(P7) UDLDG12.14(OT5)
DOT94: T3.27(P27) UDLDG12.13(OT6)
DOT95: T3.8(P8) UDLDG12.12(OT7)
DOT96: T3.28(P28) UDLDG12.11(OT8)
DOT97: T3.9(P9) UDLDG13.18(OT1)
DOT98: T3.29(P29) UDLDG13.17(OT2)
DOT99: T3.10(P10) UDLDG13.16(OT3)
DOT100: T3.30(P30) UDLDG13.15(OT4)
DOT101: T3.11(P11) UDLDG13.14(OT5)
DOT102: T3.31(P31) UDLDG13.13(OT6)
DOT103: T3.12(P12) UDLDG13.12(OT7)
DOT104: T3.32(P32) UDLDG13.11(OT8)
DOT105: T3.13(P13) UDLDG14.18(OT1)
DOT106: T3.33(P33) UDLDG14.17(OT2)
DOT107: T3.14(P14) UDLDG14.16(OT3)
DOT108: T3.34(P34) UDLDG14.15(OT4)
DOT109: T3.15(P15) UDLDG14.14(OT5)
DOT110: T3.35(P35) UDLDG14.13(OT6)
DOT111: T3.16(P16) UDLDG14.12(OT7)
DOT112: T3.36(P36) UDLDG14.11(OT8)
DOT113: T3.17(P17) UDLDG15.18(OT1)
DOT114: T3.37(P37) UDLDG15.17(OT2)
DOT115: T3.18(P18) UDLDG15.16(OT3)
DOT116: T3.38(P38) UDLDG15.15(OT4)
DOT117: T3.19(P19) UDLDG15.14(OT5)
DOT118: T3.39(P39) UDLDG15.13(OT6)
DOT119: T3.20(P20) UDLDG15.12(OT7)
DOT120: T3.40(P40) UDLDG15.11(OT8)
DOT121: T4.1(P1) UDLDG16.18(OT1)
DOT122: T4.21(P21) UDLDG16.17(OT2)
DOT123: T4.2(P2) UDLDG16.16(OT3)
DOT124: T4.22(P22) UDLDG16.15(OT4)
DOT125: T4.3(P3) UDLDG16.14(OT5)
DOT126: T4.23(P23) UDLDG16.13(OT6)
DOT127: T4.4(P4) UDLDG16.12(OT7)
DOT128: T4.24(P24) UDLDG16.11(OT8)
DOT129: T4.5(P5) UDLDG17.18(OT1)
DOT130: T4.25(P25) UDLDG17.17(OT2)
DOT131: T4.6(P6) UDLDG17.16(OT3)
DOT132: T4.26(P26) UDLDG17.15(OT4)
DOT133: T4.7(P7) UDLDG17.14(OT5)
DOT134: T4.27(P27) UDLDG17.13(OT6)
DOT135: T4.8(P8) UDLDG17.12(OT7)
DOT136: T4.28(P28) UDLDG17.11(OT8)
DOT137: T4.9(P9) UDLDG18.18(OT1)
DOT138: T4.29(P29) UDLDG18.17(OT2)
DOT139: T4.10(P10) UDLDG18.16(OT3)
DOT140: T4.30(P30) UDLDG18.15(OT4)
DOT141: T4.11(P11) UDLDG18.14(OT5)
DOT142: T4.31(P31) UDLDG18.13(OT6)
DOT143: T4.12(P12) UDLDG18.12(OT7)
DOT144: T4.32(P32) UDLDG18.11(OT8)
DOT145: T4.13(P13) UDLDG19.18(OT1)
DOT146: T4.33(P33) UDLDG19.17(OT2)
DOT147: T4.14(P14) UDLDG19.16(OT3)
DOT148: T4.34(P34) UDLDG19.15(OT4)
DOT149: T4.15(P15) UDLDG19.14(OT5)
DOT150: T4.35(P35) UDLDG19.13(OT6)
DOT151: T4.16(P16) UDLDG19.12(OT7)
DOT152: T4.36(P36) UDLDG19.11(OT8)
DOT153: T4.17(P17) UDLDG20.18(OT1)
DOT154: T4.37(P37) UDLDG20.17(OT2)
DOT155: T4.18(P18) UDLDG20.16(OT3)
DOT156: T4.38(P38) UDLDG20.15(OT4)
DOT157: T4.19(P19) UDLDG20.14(OT5)
DOT158: T4.39(P39) UDLDG20.13(OT6)
DOT159: T4.20(P20) UDLDG20.12(OT7)
DOT160: T4.40(P40) UDLDG20.11(OT8)
DOT161: T5.1(P1) UDLDG21.18(OT1)
DOT162: T5.21(P21) UDLDG21.17(OT2)
DOT163: T5.2(P2) UDLDG21.16(OT3)
DOT164: T5.22(P22) UDLDG21.15(OT4)
DOT165: T5.3(P3) UDLDG21.14(OT5)
DOT166: T5.23(P23) UDLDG21.13(OT6)
DOT167: T5.4(P4) UDLDG21.12(OT7)
DOT168: T5.24(P24) UDLDG21.11(OT8)
DOT169: T5.5(P5) UDLDG22.18(OT1)
DOT170: T5.25(P25) UDLDG22.17(OT2)
DOT171: T5.6(P6) UDLDG22.16(OT3)
DOT172: T5.26(P26) UDLDG22.15(OT4)
DOT173: T5.7(P7) UDLDG22.14(OT5)
DOT174: T5.27(P27) UDLDG22.13(OT6)
DOT175: T5.8(P8) UDLDG22.12(OT7)
DOT176: T5.28(P28) UDLDG22.11(OT8)
DOT177: T5.9(P9) UDLDG23.18(OT1)
DOT178: T5.29(P29) UDLDG23.17(OT2)
DOT179: T5.10(P10) UDLDG23.16(OT3)
DOT180: T5.30(P30) UDLDG23.15(OT4)
DOT181: T5.11(P11) UDLDG23.14(OT5)
DOT182: T5.31(P31) UDLDG23.13(OT6)
DOT183: T5.12(P12) UDLDG23.12(OT7)
DOT184: T5.32(P32) UDLDG23.11(OT8)
DOT185: T5.13(P13) UDLDG24.18(OT1)
DOT186: T5.33(P33) UDLDG24.17(OT2)
DOT187: T5.14(P14) UDLDG24.16(OT3)
DOT188: T5.34(P34) UDLDG24.15(OT4)
DOT189: T5.15(P15) UDLDG24.14(OT5)
DOT190: T5.35(P35) UDLDG24.13(OT6)
DOT191: T5.16(P16) UDLDG24.12(OT7)
DOT192: T5.36(P36) UDLDG24.11(OT8)
DOT193: T5.17(P17) UDLDG25.18(OT1)
DOT194: T5.37(P37) UDLDG25.17(OT2)
DOT195: T5.18(P18) UDLDG25.16(OT3)
DOT196: T5.38(P38) UDLDG25.15(OT4)
DOT197: T5.19(P19) UDLDG25.14(OT5)
DOT198: T5.39(P39) UDLDG25.13(OT6)
DOT199: T5.20(P20) UDLDG25.12(OT7)
DOT200: T5.40(P40) UDLDG25.11(OT8)
DOT201: T6.1(P1) UDLDG26.18(OT1)
DOT202: T6.21(P21) UDLDG26.17(OT2)
DOT203: T6.2(P2) UDLDG26.16(OT3)
DOT204: T6.22(P22) UDLDG26.15(OT4)
DOT205: T6.3(P3) UDLDG26.14(OT5)
DOT206: T6.23(P23) UDLDG26.13(OT6)
DOT207: T6.4(P4) UDLDG26.12(OT7)
DOT208: T6.24(P24) UDLDG26.11(OT8)
DOT209: T6.5(P5) UDLDG27.18(OT1)
DOT210: T6.25(P25) UDLDG27.17(OT2)
DOT211: T6.6(P6) UDLDG27.16(OT3)
DOT212: T6.26(P26) UDLDG27.15(OT4)
DOT213: T6.7(P7) UDLDG27.14(OT5)
DOT214: T6.27(P27) UDLDG27.13(OT6)
DOT215: T6.8(P8) UDLDG27.12(OT7)
DOT216: T6.28(P28) UDLDG27.11(OT8)
DOT217: T6.9(P9) UDLDG28.18(OT1)
DOT218: T6.29(P29) UDLDG28.17(OT2)
DOT219: T6.10(P10) UDLDG28.16(OT3)
DOT220: T6.30(P30) UDLDG28.15(OT4)
DOT221: T6.11(P11) UDLDG28.14(OT5)
DOT222: T6.31(P31) UDLDG28.13(OT6)
DOT223: T6.12(P12) UDLDG28.12(OT7)
DOT224: T6.32(P32) UDLDG28.11(OT8)
DOT225: T6.13(P13) UDLDG29.18(OT1)
DOT226: T6.33(P33) UDLDG29.17(OT2)
DOT227: T6.14(P14) UDLDG29.16(OT3)
DOT228: T6.34(P34) UDLDG29.15(OT4)
DOT229: T6.15(P15) UDLDG29.14(OT5)
DOT230: T6.35(P35) UDLDG29.13(OT6)
DOT231: T6.16(P16) UDLDG29.12(OT7)
DOT232: T6.36(P36) UDLDG29.11(OT8)
DOT233: T6.17(P17) UDLDG30.18(OT1)
DOT234: T6.37(P37) UDLDG30.17(OT2)
DOT235: T6.18(P18) UDLDG30.16(OT3)
DOT236: T6.38(P38) UDLDG30.15(OT4)
DOT237: T6.19(P19) UDLDG30.14(OT5)
DOT238: T6.39(P39) UDLDG30.13(OT6)
DOT239: T6.20(P20) UDLDG30.12(OT7)
DOT240: T6.40(P40) UDLDG30.11(OT8)
F_CS: R54.2 U5.27(PF6/TIM10_CH1/SPI5_NSS/SAI1_SD_B/UART7_Rx/FMC_NIORD) U7.1(~{CS})
FMC_A0: U1.23(A0) U5.16(PF0/I2C2_SDA/FMC_A0)
FMC_A1: U1.24(A1) U5.17(PF1/I2C2_SCL/FMC_A1)
FMC_A2: U1.25(A2) U5.18(PF2/I2C2_SMBA/FMC_A2)
FMC_A3: U1.26(A3) U5.22(PF3/FMC_A3)
FMC_A4: U1.29(A4) U5.23(PF4/FMC_A4)
FMC_A5: U1.30(A5) U5.24(PF5/FMC_A5)
FMC_A6: U1.31(A6) U5.71(PF12/FMC_A6)
FMC_A7: U1.32(A7) U5.74(PF13/FMC_A7)
FMC_A8: U1.33(A8) U5.75(PF14/FMC_A8)
FMC_A9: U1.34(A9) U5.76(PF15/FMC_A9)
FMC_A10: U1.22(A10) U5.77(PG0/FMC_A10)
FMC_A11: U1.35(A11) U5.78(PG1/FMC_A11)
FMC_A12: U1.36(A12/NC) U5.129(PG2/FMC_A12)
FMC_A16_CLE: U2.16(CLE) U5.111(PD11/USART3_CTS/FMC_A16)
FMC_A17_ALE: U2.17(ALE) U5.112(PD12/TIM4_CH1/USART3_RTS/FMC_A17)
FMC_BA0: U1.20(BA0) U5.131(PG4/FMC_A14/FMC_BA0)
FMC_BA1: U1.21(BA1) U5.132(PG5/FMC_A15/FMC_BA1)
FMC_D0: U1.2(DQ0) U2.29(I/O0) U5.116(PD14/TIM4_CH3/FMC_D0)
FMC_D1: U1.4(DQ1) U2.30(I/O1) U5.117(PD15/TIM4_CH4/FMC_D1)
FMC_D2: U1.5(DQ2) U2.31(I/O2) U5.164(PD0/CAN1_RX/FMC_D2)
FMC_D3: U1.7(DQ3) U2.32(I/O3) U5.165(PD1/CAN1_TX/FMC_D3)
FMC_D4: U1.8(DQ4) U2.41(I/O4) U5.79(PE7/TIM1_ETR/_UART7_Rx/_FMC_D4)
FMC_D5: U1.10(DQ5) U2.42(I/O5) U5.80(PE8/TIM1_CH1N/UART7_Tx/FMC_D5)
FMC_D6: U1.11(DQ6) U2.43(I/O6) U5.81(PE9/TIM1_CH1/FMC_D6)
FMC_D7: U1.13(DQ7) U2.44(I/O7) U5.84(PE10/TIM1_CH2N/FMC_D7)
FMC_D8: U1.42(DQ8) U5.85(PE11/TIM1_CH2/SPI4_NSS/FMC_D8/_LCD_G3)
FMC_D9: U1.44(DQ9) U5.86(PE12/TIM1_CH3N/SPI4_SCK/_FMC_D9/_LCD_B4)
FMC_D10: U1.45(DQ10) U5.87(PE13/TIM1_CH3/SPI4_MISO/FMC_D10/_LCD_DE)
FMC_D11: U1.47(DQ11) U5.88(PE14/TIM1_CH4/SPI4_MOSI/FMC_D11/LCD_CLK)
FMC_D12: U1.48(DQ12) U5.89(PE15/TIM1_BKIN/_FMC_D12/__LCD_R7)
FMC_D13: U1.50(DQ13) U5.108(PD8/USART3_TX/FMC_D13)
FMC_D14: U1.51(DQ14) U5.109(PD9/USART3_RX/FMC_D14)
FMC_D15: U1.53(DQ15) U5.110(PD10/USART3_CK/FMC_D15/LCD_B3)
FMC_NBL0: U1.15(LDQM) U5.200(PE0/TIM4_ETR/UART8_RX/FMC_NBL0/DCMI_D2)
FMC_NBL1: U1.39(UDQM) U5.201(PE1/UART8_Tx/FMC_NBL1/_DCMI_D3)
FMC_NCE3: R5.1 U2.9(~{CE}) U5.178(PG9/USART6_RX/FMC_NE2/FMC_NCE3)
FMC_NOE: U2.8(~{RE}) U5.168(PD4/USART2_RTS/FMC_NOE)
FMC_NWAIT: U2.7(R/~{B}) U5.172(PD6/SPI3_MOSI/I2S3_SD/SAI1_SD_A/USART2_RX/FMC_NWAIT/DCMI_D10/LCD_B2)
FMC_NWE: U2.18(~{WE}) U5.169(PD5/USART2_TX/FMC_NWE)
FMC_SDCKE0: U1.37(CKE) U5.38(PC3/SPI2_MOSI/I2S2_SD/OTG_HS_ULPI_NXT/ETH_MII_TX_CLK/FMC_SDCKE0)
FMC_SDCLK: U1.38(CLK) U5.135(PG8/SPI6_NSS/_USART6_RTS/__ETH_PPS_OUT/_FMC_SDCLK)
FMC_SDNCAS: U1.17(~{CAS}) U5.191(PG15/USART6_CTS/_FMC_SDNCAS)
FMC_SDNE0: R6.1 U1.19(~{CS}) U5.37(PC2/SPI2_MISO/I2S2ext_SD/OTG_HS_ULPI_DIR/ETH_MII_TXD2/FMC_SDNE0)
FMC_SDNRAS: U1.18(~{RAS}) U5.70(PF11/SPI5_MOSI/FMC_SDNRAS/DCMI_D12)
FMC_SDNWE: U1.16(~{WE}) U5.35(PC0/OTG_HS_ULPI_STP/FMC_SDNWE)
GPIO0: U5.49(PH5/I2C2_SDA/SPI5_NSS/_FMC_SDNWE)
HALL1_IN: U5.8(PC13)
IIC_SCL: R55.2 U5.97(PH7/I2C3_SCL/_SPI5_MISO/__ETH_MII_RXD3/_FMC_SDCKE1/DCMI_D9) U8.6(SCL)
IIC_SCL_2: R13.2 U4.47(IIC_SCL)
IIC_SDA: R56.2 U5.98(PH8/I2C3_SDA/_FMC_D16/_DCMI_HSYNC/_LCD_R2) U8.5(SDA)
IIC_SDA_2: R15.2 U4.48(IIC_SDA)
JTCK-SWCLK: D23.1(A) P1.4 U5.159(PA14/JTCK-SWCLK)
JTMS-SWDIO: D22.1(A) P1.3 U5.147(PA13/JTMS-SWDIO)
KEY1: K1.2 P15.1 U5.2(PE3/TRACED0/SAI1_SD_B/FMC_A19)
KEY2: K2.2 P16.1 U5.5(PE6/TRACED3/TIM9_CH2/SPI4_MOSI/SAI1_SD_A/FMC_A22/DCMI_D7/LCD_G1)
KEY3: K3.2 U5.11(PI9/CAN1_RX/_FMC_D30/_LCD_VSYNC)
KEY4: K4.2 U5.3(PE4/TRACED1/SPI4_NSS/SAI1_FS_A/FMC_A20/DCMI_D4/LCD_B0)
KEY5: K5.2 U5.4(PE5/TRACED2/_TIM9_CH1/SPI4_MISO/SAI1_SCK_A/FMC_A21/DCMI_D6/LCD_G0)
KEY6: K6.2 U5.12(PI10/ETH_MII_RX_ER/FMC_D31/LCD_HSYNC)
KEY7: U5.13(PI11/OTG_HS_ULPI_DIR)
LCD_B3: PLCD1.24 U5.177(PJ15/LCD_B3)
LCD_B4: PLCD1.25 U5.186(PK3/LCD_B4)
LCD_B5: PLCD1.26 U5.187(PK4/LCD_B5)
LCD_B6: PLCD1.27 U5.188(PK5/LCD_B6)
LCD_B7: PLCD1.28 U5.189(PK6/LCD_B7)
LCD_BL: PLCD1.34 U5.199(PB9/TIM4_CH4/TIM11_CH1/I2C1_SDA/SPI2_NSS/I2S2_WS/CAN1_TX/SDIO_D5/DCMI_D7/LCD_B7)
LCD_CLK: PLCD1.30 U5.21(PI14/LCD_CLK)
LCD_DE: PLCD1.33 U5.190(PK7/LCD_DE)
LCD_G2: PLCD1.14 U5.121(PJ9/LCD_G2)
LCD_G3: PLCD1.15 U5.122(PJ10/LCD_G3)
LCD_G4: PLCD1.16 U5.123(PJ11/LCD_G4)
LCD_G5: PLCD1.17 U5.126(PK0/LCD_G5)
LCD_G6: PLCD1.18 U5.127(PK1/LCD_G6)
LCD_G7: PLCD1.19 U5.128(PK2/LCD_G7)
LCD_HSYNC: PLCD1.31 U5.19(PI12/LCD_HSYNC)
LCD_R0: U5.64(PI15/LCD_R0)
LCD_R1: U5.65(PJ0/LCD_R1)
LCD_R2: U5.66(PJ1/LCD_R2)
LCD_R3: PLCD1.6 U5.67(PJ2/LCD_R3)
LCD_R4: PLCD1.7 U5.68(PJ3/LCD_R4)
LCD_R5: PLCD1.8 U5.69(PJ4/LCD_R5)
LCD_R6: PLCD1.9 U5.95(PJ5/LCD_R6)
LCD_R7: PLCD1.10 U5.118(PJ6/LCD_R7)
LCD_RESET: *R4.1 U5.48(PH4/I2C2_SCL/OTG_HS_ULPI_NXT)
LCD_RESIN: *R4.2 PLCD1.40 R61.2
LCD_VSYNC: PLCD1.32 U5.20(PI13/LCD_VSYNC)
MCLK: R22.2 U5.32(PH0/OSC_IN)
MIC_BIAS: C34.1 U4.12(MIC_Bias)
MIC_N: U4.13(MIC_N)
MIC_P: U4.15(MIC_P)
NRST: C4.2 D4.1 D18.1(A) D24.1(A) K7.1 P1.5 R2.2 R61.1 U5.34(NRST)
PB10_USART3TX: P14.2 R17.2 U4.39(RXD) U5.90(PB10/TIM2_CH3/I2C2_SCL/SPI2_SCK/I2S2_CK/USART3_TX/OTG_HS_ULPI_D3/ETH_MII_RX_ER)
PB11_USART3RX: P14.3 R16.2 U4.41(TXD) U5.91(PB11/TIM2_CH4/I2C2_SDA/USART3_RX/OTG_HS_ULPI_D4/ETH_MII_TX_EN/ETH_RMII_TX_EN/LCD_G5)
RDY: D1.2(K) R26.1 U4.40(RDY)
SCQ_D1: U5.156(PI2/TIM8_CH4/_SPI2_MISO/__I2S2ext_SD/_FMC_D26/DCMI_D9/_LCD_G7) USCQ1.2(D1) USCQ2.2(D1) USCQ3.2(D1) USCQ4.2(D1) USCQ5.2(D1) USCQ6.2(D1) USCQ7.2(D1) USCQ8.2(D1) USCQ9.2(D1) USCQ10.2(D1) USCQ11.2(D1) USCQ12.2(D1) USCQ13.2(D1) USCQ14.2(D1) USCQ15.2(D1) USCQ16.2(D1) USCQ17.2(D1) USCQ18.2(D1) USCQ19.2(D1) USCQ20.2(D1) USCQ21.2(D1) USCQ22.2(D1) USCQ23.2(D1) USCQ24.2(D1) USCQ25.2(D1) USCQ26.2(D1) USCQ27.2(D1) USCQ28.2(D1) USCQ29.2(D1) USCQ30.2(D1)
SCQ_D2: U5.155(PI1/SPI2_SCK/I2S2_CK(6)/__FMC_D25/DCMI_D8/__LCD_G6) USCQ1.3(D2) USCQ2.3(D2) USCQ3.3(D2) USCQ4.3(D2) USCQ5.3(D2) USCQ6.3(D2) USCQ7.3(D2) USCQ8.3(D2) USCQ9.3(D2) USCQ10.3(D2) USCQ11.3(D2) USCQ12.3(D2) USCQ13.3(D2) USCQ14.3(D2) USCQ15.3(D2) USCQ16.3(D2) USCQ17.3(D2) USCQ18.3(D2) USCQ19.3(D2) USCQ20.3(D2) USCQ21.3(D2) USCQ22.3(D2) USCQ23.3(D2) USCQ24.3(D2) USCQ25.3(D2) USCQ26.3(D2) USCQ27.3(D2) USCQ28.3(D2) USCQ29.3(D2) USCQ30.3(D2)
SCQ_D3: U5.154(PI0/TIM5_CH4/__SPI2_NSS/I2S2_WS(6)/__FMC_D24/_DCMI_D13/__LCD_G5) USCQ1.4(D3) USCQ2.4(D3) USCQ3.4(D3) USCQ4.4(D3) USCQ5.4(D3) USCQ6.4(D3) USCQ7.4(D3) USCQ8.4(D3) USCQ9.4(D3) USCQ10.4(D3) USCQ11.4(D3) USCQ12.4(D3) USCQ13.4(D3) USCQ14.4(D3) USCQ15.4(D3) USCQ16.4(D3) USCQ17.4(D3) USCQ18.4(D3) USCQ19.4(D3) USCQ20.4(D3) USCQ21.4(D3) USCQ22.4(D3) USCQ23.4(D3) USCQ24.4(D3) USCQ25.4(D3) USCQ26.4(D3) USCQ27.4(D3) USCQ28.4(D3) USCQ29.4(D3) USCQ30.4(D3)
SCQ_D4: U5.153(PH15/TIM8_CH3N/_FMC_D23/_DCMI_D11/_LCD_G4) USCQ1.5(D4) USCQ2.5(D4) USCQ3.5(D4) USCQ4.5(D4) USCQ5.5(D4) USCQ6.5(D4) USCQ7.5(D4) USCQ8.5(D4) USCQ9.5(D4) USCQ10.5(D4) USCQ11.5(D4) USCQ12.5(D4) USCQ13.5(D4) USCQ14.5(D4) USCQ15.5(D4) USCQ16.5(D4) USCQ17.5(D4) USCQ18.5(D4) USCQ19.5(D4) USCQ20.5(D4) USCQ21.5(D4) USCQ22.5(D4) USCQ23.5(D4) USCQ24.5(D4) USCQ25.5(D4) USCQ26.5(D4) USCQ27.5(D4) USCQ28.5(D4) USCQ29.5(D4) USCQ30.5(D4)
SCQ_D5: U5.152(PH14/TIM8_CH2N/FMC_D22/DCMI_D4/_LCD_G3) USCQ1.6(D5) USCQ2.6(D5) USCQ3.6(D5) USCQ4.6(D5) USCQ5.6(D5) USCQ6.6(D5) USCQ7.6(D5) USCQ8.6(D5) USCQ9.6(D5) USCQ10.6(D5) USCQ11.6(D5) USCQ12.6(D5) USCQ13.6(D5) USCQ14.6(D5) USCQ15.6(D5) USCQ16.6(D5) USCQ17.6(D5) USCQ18.6(D5) USCQ19.6(D5) USCQ20.6(D5) USCQ21.6(D5) USCQ22.6(D5) USCQ23.6(D5) USCQ24.6(D5) USCQ25.6(D5) USCQ26.6(D5) USCQ27.6(D5) USCQ28.6(D5) USCQ29.6(D5) USCQ30.6(D5)
SCQ_D6: U5.151(PH13/TIM8_CH1N/_CAN1_TX/FMC_D21/_LCD_G2) USCQ1.7(D6) USCQ2.7(D6) USCQ3.7(D6) USCQ4.7(D6) USCQ5.7(D6) USCQ6.7(D6) USCQ7.7(D6) USCQ8.7(D6) USCQ9.7(D6) USCQ10.7(D6) USCQ11.7(D6) USCQ12.7(D6) USCQ13.7(D6) USCQ14.7(D6) USCQ15.7(D6) USCQ16.7(D6) USCQ17.7(D6) USCQ18.7(D6) USCQ19.7(D6) USCQ20.7(D6) USCQ21.7(D6) USCQ22.7(D6) USCQ23.7(D6) USCQ24.7(D6) USCQ25.7(D6) USCQ26.7(D6) USCQ27.7(D6) USCQ28.7(D6) USCQ29.7(D6) USCQ30.7(D6)
SCQ_D7: U5.146(PA12/TIM1_ETR/USART1_RTS/CAN1_TX/LCD_R5/OTG_FS_DP) USCQ1.8(D7) USCQ2.8(D7) USCQ3.8(D7) USCQ4.8(D7) USCQ5.8(D7) USCQ6.8(D7) USCQ7.8(D7) USCQ8.8(D7) USCQ9.8(D7) USCQ10.8(D7) USCQ11.8(D7) USCQ12.8(D7) USCQ13.8(D7) USCQ14.8(D7) USCQ15.8(D7) USCQ16.8(D7) USCQ17.8(D7) USCQ18.8(D7) USCQ19.8(D7) USCQ20.8(D7) USCQ21.8(D7) USCQ22.8(D7) USCQ23.8(D7) USCQ24.8(D7) USCQ25.8(D7) USCQ26.8(D7) USCQ27.8(D7) USCQ28.8(D7) USCQ29.8(D7) USCQ30.8(D7)
SCQ_D8: U5.145(PA11/TIM1_CH4/_USART1_CTS/CAN1_RX/LCD_R4/OTG_FS_DM) USCQ1.9(D8) USCQ2.9(D8) USCQ3.9(D8) USCQ4.9(D8) USCQ5.9(D8) USCQ6.9(D8) USCQ7.9(D8) USCQ8.9(D8) USCQ9.9(D8) USCQ10.9(D8) USCQ11.9(D8) USCQ12.9(D8) USCQ13.9(D8) USCQ14.9(D8) USCQ15.9(D8) USCQ16.9(D8) USCQ17.9(D8) USCQ18.9(D8) USCQ19.9(D8) USCQ20.9(D8) USCQ21.9(D8) USCQ22.9(D8) USCQ23.9(D8) USCQ24.9(D8) USCQ25.9(D8) USCQ26.9(D8) USCQ27.9(D8) USCQ28.9(D8) USCQ29.9(D8) USCQ30.9(D8)
SCQ_LE1: U5.208(PI7/TIM8_CH3/FMC_D29/__DCMI_D7/LCD_B7) USCQ1.11(LE)
SCQ_LE2: U5.206(PI5/TIM8_CH1/_FMC_NBL3/DCMI_VSYNC/_LCD_B5) USCQ2.11(LE)
SCQ_LE3: U5.176(PJ14/LCD_B2,) USCQ3.11(LE)
SCQ_LE4: U5.174(PJ12/LCD_B0) USCQ4.11(LE)
SCQ_LE5: U5.167(PD3/SPI2_SCK/I2S2_CK/USART2_CTS/FMC_CLK/DCMI_D5) USCQ5.11(LE)
SCQ_LE6: U5.157(PI3/TIM8_ETR/_SPI2_MOSI/I2S2_SD/_FMC_D27/_DCMI_D10) USCQ6.11(LE)
SCQ_LE7: U5.139(PC7/TIM3_CH2/TIM8_CH2/I2S3_MCK/USART6_RX/SDIO_D7/DCMI_D1) USCQ7.11(LE)
SCQ_LE8: U5.134(PG7/USART6_CK/_FMC_INT3/__DCMI_D13/_LCD_CLK) USCQ8.11(LE)
SCQ_LE9: U5.130(PG3/FMC_A13) USCQ9.11(LE)
SCQ_LE10: U5.119(PJ7/LCD_G0) USCQ10.11(LE)
SCQ_LE11: U5.105(PB13/TIM1_CH1N/SPI2_SCK/I2S2_CK/USART3_CTS/CAN2_TX/OTG_HS_ULPI_D6/ETH_MII_TXD1/ETH_RMI__I_TXD1) USCQ11.11(LE)
SCQ_LE12: U5.107(PB15/RTC_REFIN/TIM1_CH3N/TIM8_CH3N/SPI2_MOSI/I2S2_SD/TIM12_CH2/OTG_HS_DP) USCQ12.11(LE)
SCQ_LE13: U5.102(PH12/TIM5_CH3/_FMC_D20/_DCMI_D3/_LCD_R6) USCQ13.11(LE)
SCQ_LE14: U5.100(PH10/TIM5_CH1/FMC_D18/_DCMI_D1/LCD_R4) USCQ14.11(LE)
SCQ_LE15: U5.96(PH6/I2C2_SMBA/SPI5_SCK/__TIM12_CH1/ETH_MII_RXD2/FMC_SDNE1/DCMI_D8) USCQ15.11(LE)
SCQ_LE16: U5.1(PE2/TRACECLK/SPI4_SCK/SAI1_MCLK_A/ETH_MII_TXD3/FMC_A23) USCQ16.11(LE)
SCQ_LE17: U5.207(PI6/TIM8_CH2,_FMC_D28/DCMI_D6/_LCD_B6) USCQ17.11(LE)
SCQ_LE18: U5.205(PI4/TIM8_BKIN/_FMC_NBL2/DCMI_D5/_LCD_B4) USCQ18.11(LE)
SCQ_LE19: U5.175(PJ13/LCD_B1) USCQ19.11(LE)
SCQ_LE20: U5.173(PD7/USART2_CK/FMC_NE1/FMC_NCE2) USCQ20.11(LE)
SCQ_LE21: U5.160(PA15/JTDI/TIM2_CH1/TIM2_ETR/SPI1_NSS/SPI3_NSS/I2S3_WS) USCQ21.11(LE)
SCQ_LE22: U5.142(PA8/MCO1/TIM1_CH1/_I2C3_SCL/USART1_CK/OTG_FS_SOF/LCD_R6) USCQ22.11(LE)
SCQ_LE23: U5.138(PC6/TIM3_CH1/TIM8_CH1/_I2S2_MCK/USART6_TX/SDIO_D6/DCMI_D0/LCD_HSYNC) USCQ23.11(LE)
SCQ_LE24: U5.133(PG6/FMC_INT2/_DCMI_D12) USCQ24.11(LE)
SCQ_LE25: U5.120(PJ8/LCD_G1) USCQ25.11(LE)
SCQ_LE26: U5.113(PD13/TIM4_CH2/_FMC_A18) USCQ26.11(LE)
SCQ_LE27: U5.106(PB14/TIM1_CH2N/TIM8_CH2N/SPI2_MISO/I2S2ext_SD/USART3_RTS/TIM12_CH1/OTG_HS_DM) USCQ27.11(LE)
SCQ_LE28: U5.104(PB12/TIM1_BKIN/_I2C2_SMBA/_SPI2_NSS/I2S2_WS/USART3_CK/_CAN2_RX/OTG_HS_ULPI_D5/ETH_MII_TXD0/ETH_RMI__I_TXD0/OTG_HS_ID) USCQ28.11(LE)
SCQ_LE29: U5.101(PH11/TIM5_CH2/FMC_D19/_DCMI_D2/LCD_R5) USCQ29.11(LE)
SCQ_LE30: U5.99(PH9/I2C3_SMBA/_TIM12_CH2/_FMC_D17/DCMI_D0/LCD_R3) USCQ30.11(LE)
SCQ_Q1: UDLDG1.1(IN1) USCQ1.19(Q1)
SCQ_Q2: UDLDG1.2(IN2) USCQ1.18(Q2)
SCQ_Q3: UDLDG1.3(IN3) USCQ1.17(Q3)
SCQ_Q4: UDLDG1.4(IN4) USCQ1.16(Q4)
SCQ_Q5: UDLDG1.5(IN5) USCQ1.15(Q5)
SCQ_Q6: UDLDG1.6(IN6) USCQ1.14(Q6)
SCQ_Q7: UDLDG1.7(IN7) USCQ1.13(Q7)
SCQ_Q8: UDLDG1.8(IN8) USCQ1.12(Q8)
SCQ_Q9: UDLDG2.1(IN1) USCQ2.19(Q1)
SCQ_Q10: UDLDG2.2(IN2) USCQ2.18(Q2)
SCQ_Q11: UDLDG2.3(IN3) USCQ2.17(Q3)
SCQ_Q12: UDLDG2.4(IN4) USCQ2.16(Q4)
SCQ_Q13: UDLDG2.5(IN5) USCQ2.15(Q5)
SCQ_Q14: UDLDG2.6(IN6) USCQ2.14(Q6)
SCQ_Q15: UDLDG2.7(IN7) USCQ2.13(Q7)
SCQ_Q16: UDLDG2.8(IN8) USCQ2.12(Q8)
SCQ_Q17: UDLDG3.1(IN1) USCQ3.19(Q1)
SCQ_Q18: UDLDG3.2(IN2) USCQ3.18(Q2)
SCQ_Q19: UDLDG3.3(IN3) USCQ3.17(Q3)
SCQ_Q20: UDLDG3.4(IN4) USCQ3.16(Q4)
SCQ_Q21: UDLDG3.5(IN5) USCQ3.15(Q5)
SCQ_Q22: UDLDG3.6(IN6) USCQ3.14(Q6)
SCQ_Q23: UDLDG3.7(IN7) USCQ3.13(Q7)
SCQ_Q24: UDLDG3.8(IN8) USCQ3.12(Q8)
SCQ_Q25: UDLDG4.1(IN1) USCQ4.19(Q1)
SCQ_Q26: UDLDG4.2(IN2) USCQ4.18(Q2)
SCQ_Q27: UDLDG4.3(IN3) USCQ4.17(Q3)
SCQ_Q28: UDLDG4.4(IN4) USCQ4.16(Q4)
SCQ_Q29: UDLDG4.5(IN5) USCQ4.15(Q5)
SCQ_Q30: UDLDG4.6(IN6) USCQ4.14(Q6)
SCQ_Q31: UDLDG4.7(IN7) USCQ4.13(Q7)
SCQ_Q32: UDLDG4.8(IN8) USCQ4.12(Q8)
SCQ_Q33: UDLDG5.1(IN1) USCQ5.19(Q1)
SCQ_Q34: UDLDG5.2(IN2) USCQ5.18(Q2)
SCQ_Q35: UDLDG5.3(IN3) USCQ5.17(Q3)
SCQ_Q36: UDLDG5.4(IN4) USCQ5.16(Q4)
SCQ_Q37: UDLDG5.5(IN5) USCQ5.15(Q5)
SCQ_Q38: UDLDG5.6(IN6) USCQ5.14(Q6)
SCQ_Q39: UDLDG5.7(IN7) USCQ5.13(Q7)
SCQ_Q40: UDLDG5.8(IN8) USCQ5.12(Q8)
SCQ_Q41: UDLDG6.1(IN1) USCQ6.19(Q1)
SCQ_Q42: UDLDG6.2(IN2) USCQ6.18(Q2)
SCQ_Q43: UDLDG6.3(IN3) USCQ6.17(Q3)
SCQ_Q44: UDLDG6.4(IN4) USCQ6.16(Q4)
SCQ_Q45: UDLDG6.5(IN5) USCQ6.15(Q5)
SCQ_Q46: UDLDG6.6(IN6) USCQ6.14(Q6)
SCQ_Q47: UDLDG6.7(IN7) USCQ6.13(Q7)
SCQ_Q48: UDLDG6.8(IN8) USCQ6.12(Q8)
SCQ_Q49: UDLDG7.1(IN1) USCQ7.19(Q1)
SCQ_Q50: UDLDG7.2(IN2) USCQ7.18(Q2)
SCQ_Q51: UDLDG7.3(IN3) USCQ7.17(Q3)
SCQ_Q52: UDLDG7.4(IN4) USCQ7.16(Q4)
SCQ_Q53: UDLDG7.5(IN5) USCQ7.15(Q5)
SCQ_Q54: UDLDG7.6(IN6) USCQ7.14(Q6)
SCQ_Q55: UDLDG7.7(IN7) USCQ7.13(Q7)
SCQ_Q56: UDLDG7.8(IN8) USCQ7.12(Q8)
SCQ_Q57: UDLDG8.1(IN1) USCQ8.19(Q1)
SCQ_Q58: UDLDG8.2(IN2) USCQ8.18(Q2)
SCQ_Q59: UDLDG8.3(IN3) USCQ8.17(Q3)
SCQ_Q60: UDLDG8.4(IN4) USCQ8.16(Q4)
SCQ_Q61: UDLDG8.5(IN5) USCQ8.15(Q5)
SCQ_Q62: UDLDG8.6(IN6) USCQ8.14(Q6)
SCQ_Q63: UDLDG8.7(IN7) USCQ8.13(Q7)
SCQ_Q64: UDLDG8.8(IN8) USCQ8.12(Q8)
SCQ_Q65: UDLDG9.1(IN1) USCQ9.19(Q1)
SCQ_Q66: UDLDG9.2(IN2) USCQ9.18(Q2)
SCQ_Q67: UDLDG9.3(IN3) USCQ9.17(Q3)
SCQ_Q68: UDLDG9.4(IN4) USCQ9.16(Q4)
SCQ_Q69: UDLDG9.5(IN5) USCQ9.15(Q5)
SCQ_Q70: UDLDG9.6(IN6) USCQ9.14(Q6)
SCQ_Q71: UDLDG9.7(IN7) USCQ9.13(Q7)
SCQ_Q72: UDLDG9.8(IN8) USCQ9.12(Q8)
SCQ_Q73: UDLDG10.1(IN1) USCQ10.19(Q1)
SCQ_Q74: UDLDG10.2(IN2) USCQ10.18(Q2)
SCQ_Q75: UDLDG10.3(IN3) USCQ10.17(Q3)
SCQ_Q76: UDLDG10.4(IN4) USCQ10.16(Q4)
SCQ_Q77: UDLDG10.5(IN5) USCQ10.15(Q5)
SCQ_Q78: UDLDG10.6(IN6) USCQ10.14(Q6)
SCQ_Q79: UDLDG10.7(IN7) USCQ10.13(Q7)
SCQ_Q80: UDLDG10.8(IN8) USCQ10.12(Q8)
SCQ_Q81: UDLDG11.1(IN1) USCQ11.19(Q1)
SCQ_Q82: UDLDG11.2(IN2) USCQ11.18(Q2)
SCQ_Q83: UDLDG11.3(IN3) USCQ11.17(Q3)
SCQ_Q84: UDLDG11.4(IN4) USCQ11.16(Q4)
SCQ_Q85: UDLDG11.5(IN5) USCQ11.15(Q5)
SCQ_Q86: UDLDG11.6(IN6) USCQ11.14(Q6)
SCQ_Q87: UDLDG11.7(IN7) USCQ11.13(Q7)
SCQ_Q88: UDLDG11.8(IN8) USCQ11.12(Q8)
SCQ_Q89: UDLDG12.1(IN1) USCQ12.19(Q1)
SCQ_Q90: UDLDG12.2(IN2) USCQ12.18(Q2)
SCQ_Q91: UDLDG12.3(IN3) USCQ12.17(Q3)
SCQ_Q92: UDLDG12.4(IN4) USCQ12.16(Q4)
SCQ_Q93: UDLDG12.5(IN5) USCQ12.15(Q5)
SCQ_Q94: UDLDG12.6(IN6) USCQ12.14(Q6)
SCQ_Q95: UDLDG12.7(IN7) USCQ12.13(Q7)
SCQ_Q96: UDLDG12.8(IN8) USCQ12.12(Q8)
SCQ_Q97: UDLDG13.1(IN1) USCQ13.19(Q1)
SCQ_Q98: UDLDG13.2(IN2) USCQ13.18(Q2)
SCQ_Q99: UDLDG13.3(IN3) USCQ13.17(Q3)
SCQ_Q100: UDLDG13.4(IN4) USCQ13.16(Q4)
SCQ_Q101: UDLDG13.5(IN5) USCQ13.15(Q5)
SCQ_Q102: UDLDG13.6(IN6) USCQ13.14(Q6)
SCQ_Q103: UDLDG13.7(IN7) USCQ13.13(Q7)
SCQ_Q104: UDLDG13.8(IN8) USCQ13.12(Q8)
SCQ_Q105: UDLDG14.1(IN1) USCQ14.19(Q1)
SCQ_Q106: UDLDG14.2(IN2) USCQ14.18(Q2)
SCQ_Q107: UDLDG14.3(IN3) USCQ14.17(Q3)
SCQ_Q108: UDLDG14.4(IN4) USCQ14.16(Q4)
SCQ_Q109: UDLDG14.5(IN5) USCQ14.15(Q5)
SCQ_Q110: UDLDG14.6(IN6) USCQ14.14(Q6)
SCQ_Q111: UDLDG14.7(IN7) USCQ14.13(Q7)
SCQ_Q112: UDLDG14.8(IN8) USCQ14.12(Q8)
SCQ_Q113: UDLDG15.1(IN1) USCQ15.19(Q1)
SCQ_Q114: UDLDG15.2(IN2) USCQ15.18(Q2)
SCQ_Q115: UDLDG15.3(IN3) USCQ15.17(Q3)
SCQ_Q116: UDLDG15.4(IN4) USCQ15.16(Q4)
SCQ_Q117: UDLDG15.5(IN5) USCQ15.15(Q5)
SCQ_Q118: UDLDG15.6(IN6) USCQ15.14(Q6)
SCQ_Q119: UDLDG15.7(IN7) USCQ15.13(Q7)
SCQ_Q120: UDLDG15.8(IN8) USCQ15.12(Q8)
SCQ_Q121: UDLDG16.1(IN1) USCQ16.19(Q1)
SCQ_Q122: UDLDG16.2(IN2) USCQ16.18(Q2)
SCQ_Q123: UDLDG16.3(IN3) USCQ16.17(Q3)
SCQ_Q124: UDLDG16.4(IN4) USCQ16.16(Q4)
SCQ_Q125: UDLDG16.5(IN5) USCQ16.15(Q5)
SCQ_Q126: UDLDG16.6(IN6) USCQ16.14(Q6)
SCQ_Q127: UDLDG16.7(IN7) USCQ16.13(Q7)
SCQ_Q128: UDLDG16.8(IN8) USCQ16.12(Q8)
SCQ_Q129: UDLDG17.1(IN1) USCQ17.19(Q1)
SCQ_Q130: UDLDG17.2(IN2) USCQ17.18(Q2)
SCQ_Q131: UDLDG17.3(IN3) USCQ17.17(Q3)
SCQ_Q132: UDLDG17.4(IN4) USCQ17.16(Q4)
SCQ_Q133: UDLDG17.5(IN5) USCQ17.15(Q5)
SCQ_Q134: UDLDG17.6(IN6) USCQ17.14(Q6)
SCQ_Q135: UDLDG17.7(IN7) USCQ17.13(Q7)
SCQ_Q136: UDLDG17.8(IN8) USCQ17.12(Q8)
SCQ_Q137: UDLDG18.1(IN1) USCQ18.19(Q1)
SCQ_Q138: UDLDG18.2(IN2) USCQ18.18(Q2)
SCQ_Q139: UDLDG18.3(IN3) USCQ18.17(Q3)
SCQ_Q140: UDLDG18.4(IN4) USCQ18.16(Q4)
SCQ_Q141: UDLDG18.5(IN5) USCQ18.15(Q5)
SCQ_Q142: UDLDG18.6(IN6) USCQ18.14(Q6)
SCQ_Q143: UDLDG18.7(IN7) USCQ18.13(Q7)
SCQ_Q144: UDLDG18.8(IN8) USCQ18.12(Q8)
SCQ_Q145: UDLDG19.1(IN1) USCQ19.19(Q1)
SCQ_Q146: UDLDG19.2(IN2) USCQ19.18(Q2)
SCQ_Q147: UDLDG19.3(IN3) USCQ19.17(Q3)
SCQ_Q148: UDLDG19.4(IN4) USCQ19.16(Q4)
SCQ_Q149: UDLDG19.5(IN5) USCQ19.15(Q5)
SCQ_Q150: UDLDG19.6(IN6) USCQ19.14(Q6)
SCQ_Q151: UDLDG19.7(IN7) USCQ19.13(Q7)
SCQ_Q152: UDLDG19.8(IN8) USCQ19.12(Q8)
SCQ_Q153: UDLDG20.1(IN1) USCQ20.19(Q1)
SCQ_Q154: UDLDG20.2(IN2) USCQ20.18(Q2)
SCQ_Q155: UDLDG20.3(IN3) USCQ20.17(Q3)
SCQ_Q156: UDLDG20.4(IN4) USCQ20.16(Q4)
SCQ_Q157: UDLDG20.5(IN5) USCQ20.15(Q5)
SCQ_Q158: UDLDG20.6(IN6) USCQ20.14(Q6)
SCQ_Q159: UDLDG20.7(IN7) USCQ20.13(Q7)
SCQ_Q160: UDLDG20.8(IN8) USCQ20.12(Q8)
SCQ_Q161: UDLDG21.1(IN1) USCQ21.19(Q1)
SCQ_Q162: UDLDG21.2(IN2) USCQ21.18(Q2)
SCQ_Q163: UDLDG21.3(IN3) USCQ21.17(Q3)
SCQ_Q164: UDLDG21.4(IN4) USCQ21.16(Q4)
SCQ_Q165: UDLDG21.5(IN5) USCQ21.15(Q5)
SCQ_Q166: UDLDG21.6(IN6) USCQ21.14(Q6)
SCQ_Q167: UDLDG21.7(IN7) USCQ21.13(Q7)
SCQ_Q168: UDLDG21.8(IN8) USCQ21.12(Q8)
SCQ_Q169: UDLDG22.1(IN1) USCQ22.19(Q1)
SCQ_Q170: UDLDG22.2(IN2) USCQ22.18(Q2)
SCQ_Q171: UDLDG22.3(IN3) USCQ22.17(Q3)
SCQ_Q172: UDLDG22.4(IN4) USCQ22.16(Q4)
SCQ_Q173: UDLDG22.5(IN5) USCQ22.15(Q5)
SCQ_Q174: UDLDG22.6(IN6) USCQ22.14(Q6)
SCQ_Q175: UDLDG22.7(IN7) USCQ22.13(Q7)
SCQ_Q176: UDLDG22.8(IN8) USCQ22.12(Q8)
SCQ_Q177: UDLDG23.1(IN1) USCQ23.19(Q1)
SCQ_Q178: UDLDG23.2(IN2) USCQ23.18(Q2)
SCQ_Q179: UDLDG23.3(IN3) USCQ23.17(Q3)
SCQ_Q180: UDLDG23.4(IN4) USCQ23.16(Q4)
SCQ_Q181: UDLDG23.5(IN5) USCQ23.15(Q5)
SCQ_Q182: UDLDG23.6(IN6) USCQ23.14(Q6)
SCQ_Q183: UDLDG23.7(IN7) USCQ23.13(Q7)
SCQ_Q184: UDLDG23.8(IN8) USCQ23.12(Q8)
SCQ_Q185: UDLDG24.1(IN1) USCQ24.19(Q1)
SCQ_Q186: UDLDG24.2(IN2) USCQ24.18(Q2)
SCQ_Q187: UDLDG24.3(IN3) USCQ24.17(Q3)
SCQ_Q188: UDLDG24.4(IN4) USCQ24.16(Q4)
SCQ_Q189: UDLDG24.5(IN5) USCQ24.15(Q5)
SCQ_Q190: UDLDG24.6(IN6) USCQ24.14(Q6)
SCQ_Q191: UDLDG24.7(IN7) USCQ24.13(Q7)
SCQ_Q192: UDLDG24.8(IN8) USCQ24.12(Q8)
SCQ_Q193: UDLDG25.1(IN1) USCQ25.19(Q1)
SCQ_Q194: UDLDG25.2(IN2) USCQ25.18(Q2)
SCQ_Q195: UDLDG25.3(IN3) USCQ25.17(Q3)
SCQ_Q196: UDLDG25.4(IN4) USCQ25.16(Q4)
SCQ_Q197: UDLDG25.5(IN5) USCQ25.15(Q5)
SCQ_Q198: UDLDG25.6(IN6) USCQ25.14(Q6)
SCQ_Q199: UDLDG25.7(IN7) USCQ25.13(Q7)
SCQ_Q200: UDLDG25.8(IN8) USCQ25.12(Q8)
SCQ_Q201: UDLDG26.1(IN1) USCQ26.19(Q1)
SCQ_Q202: UDLDG26.2(IN2) USCQ26.18(Q2)
SCQ_Q203: UDLDG26.3(IN3) USCQ26.17(Q3)
SCQ_Q204: UDLDG26.4(IN4) USCQ26.16(Q4)
SCQ_Q205: UDLDG26.5(IN5) USCQ26.15(Q5)
SCQ_Q206: UDLDG26.6(IN6) USCQ26.14(Q6)
SCQ_Q207: UDLDG26.7(IN7) USCQ26.13(Q7)
SCQ_Q208: UDLDG26.8(IN8) USCQ26.12(Q8)
SCQ_Q209: UDLDG27.1(IN1) USCQ27.19(Q1)
SCQ_Q210: UDLDG27.2(IN2) USCQ27.18(Q2)
SCQ_Q211: UDLDG27.3(IN3) USCQ27.17(Q3)
SCQ_Q212: UDLDG27.4(IN4) USCQ27.16(Q4)
SCQ_Q213: UDLDG27.5(IN5) USCQ27.15(Q5)
SCQ_Q214: UDLDG27.6(IN6) USCQ27.14(Q6)
SCQ_Q215: UDLDG27.7(IN7) USCQ27.13(Q7)
SCQ_Q216: UDLDG27.8(IN8) USCQ27.12(Q8)
SCQ_Q217: UDLDG28.1(IN1) USCQ28.19(Q1)
SCQ_Q218: UDLDG28.2(IN2) USCQ28.18(Q2)
SCQ_Q219: UDLDG28.3(IN3) USCQ28.17(Q3)
SCQ_Q220: UDLDG28.4(IN4) USCQ28.16(Q4)
SCQ_Q221: UDLDG28.5(IN5) USCQ28.15(Q5)
SCQ_Q222: UDLDG28.6(IN6) USCQ28.14(Q6)
SCQ_Q223: UDLDG28.7(IN7) USCQ28.13(Q7)
SCQ_Q224: UDLDG28.8(IN8) USCQ28.12(Q8)
SCQ_Q225: UDLDG29.1(IN1) USCQ29.19(Q1)
SCQ_Q226: UDLDG29.2(IN2) USCQ29.18(Q2)
SCQ_Q227: UDLDG29.3(IN3) USCQ29.17(Q3)
SCQ_Q228: UDLDG29.4(IN4) USCQ29.16(Q4)
SCQ_Q229: UDLDG29.5(IN5) USCQ29.15(Q5)
SCQ_Q230: UDLDG29.6(IN6) USCQ29.14(Q6)
SCQ_Q231: UDLDG29.7(IN7) USCQ29.13(Q7)
SCQ_Q232: UDLDG29.8(IN8) USCQ29.12(Q8)
SCQ_Q233: UDLDG30.1(IN1) USCQ30.19(Q1)
SCQ_Q234: UDLDG30.2(IN2) USCQ30.18(Q2)
SCQ_Q235: UDLDG30.3(IN3) USCQ30.17(Q3)
SCQ_Q236: UDLDG30.4(IN4) USCQ30.16(Q4)
SCQ_Q237: UDLDG30.5(IN5) USCQ30.15(Q5)
SCQ_Q238: UDLDG30.6(IN6) USCQ30.14(Q6)
SCQ_Q239: UDLDG30.7(IN7) USCQ30.13(Q7)
SCQ_Q240: UDLDG30.8(IN8) USCQ30.12(Q8)
SDIO_CK: J1.5(CLK/SCLK) U5.163(PC12/SPI3_MOSI/I2S3_SD/USART3_CK/UART5_TX/SDIO_CK/DCMI_D9)
SDIO_CMD: J1.2(CMD/DI) R10.1 U5.166(PD2/TIM3_ETR/UART5_RX/SDIO_CMD/DCMI_D11)
SDIO_D0: J1.7(DAT0/DO) R11.1 U5.140(PC8/TIM3_CH3/TIM8_CH3/USART6_CK/SDIO_D0/DCMI_D2)
SDIO_D1: J1.8(DAT1) R12.1 U5.141(PC9/MCO2/TIM3_CH4/TIM8_CH4/I2C3_SDA/I2S_CKIN/SDIO_D1/DCMI_D3)
SDIO_D2: J1.9(DAT2) R8.1 U5.161(PC10/SPI3_SCK/I2S3_CK/USART3_TX/UART4_TX/SDIO_D2/_DCMI_D8/LCD_R2)
SDIO_D3: J1.1(CD/DAT3/CS) R9.1 U5.162(PC11/I2S3ext_SD/SPI3_MISO/USART3_RX/UART4_RX/SDIO_D3/DCMI_D4)
speed: U5.62(PB1/TIM1_CH3N/TIM3_CH4/TIM8_CH3N/LCD_R6/OTG_HS_ULPI_D2/ETH_MII_RXD3)
SPI5_MISO: U5.29(PF8/SPI5_MISO/SAI1_SCK_B/TIM13_CH1/FMC_NIOWR) U7.2(SO(IO1))
SPI5_MOSI: U5.30(PF9/SPI5_MOSI/_SAI1_FS_B/_TIM14_CH1/FMC_CD) U7.5(SI(IO0))
SPI5_SCK: U5.28(PF7/TIM11_CH1/SPI5_SCK/SAI1_MCLK_B/UART7_Tx/FMC_NREG) U7.6(CLK)
SPI_CLK: U4.42(SPI_CLK)
SPI_CS: R14.2 U4.43(SPI_SSEL)
SPI_MISO: U4.45(SPI_SO)
SPI_MOSI: U4.44(SPI_SI)
SPKL: J2.2 R18.2 U6.5(VO1)
SPKN: J2.1 U6.8(VO2)
TP_CS: PLCD1.35 U5.180(PG11/ETH_MII_TX_EN/ETH_R__MII_TX_EN/_FMC_NCE4_2/_DCMI_D3/__LCD_B3)
TP_MISO: PLCD1.37 U5.181(PG12/SPI6_MISO/_USART6_RTS/_LCD_B4/__FMC_NE4/LCD_B1)
TP_MOSI: PLCD1.36 U5.183(PG14/SPI6_MOSI/_USART6_TX/__ETH_MII_TXD1/ETH_RMI__I_TXD1/FMC_A25)
TP_PEN: PLCD1.39 U5.46(PH2/ETH_MII_CRS/FMC_SDCKE0/_LCD_R0)
TP_SCK: PLCD1.38 U5.182(PG13/SPI6_SCK/__USART6_CTS/_ETH_MII_TXD0/ETH_RMI__I_TXD0/FMC_A24)
USART1_RX: U5.144(PA10/TIM1_CH3/USART1_RX/OTG_FS_ID/DCMI_D1) U9.2(TXD)
USART1_TX: U5.143(PA9/TIM1_CH2/_I2C3_SMBA/USART1_TX/DCMI_D0) U9.3(RXD)
USART2_RX: U5.50(PA3/TIM2_CH4/_TIM5_CH4/TIM9_CH2/USART2_RX/OTG_HS_ULPI_D0/_ETH_MII_COL/LCD_B5) WK1.2
USART2_TX: U5.45(PA2/USART2_TX/ETH_MDIO/ADC_IN2) WK1.1
VREF: C36.1 U4.18(VREF)
WCLOCKRST: DS1.5(~{RST}) U5.198(PB8/TIM4_CH3/TIM10_CH1/I2C1_SCL/CAN1_RX/_ETH_MII_TXD3/SDIO_D4/DCMI_D6)
WCLOCKSCL: DS1.7(SCLK) U5.195(PB6/TIM4_CH1/I2C1_SCL/USART1_TX/CAN2_TX/FMC_SDNE1/DCMI_D5)
WCLOCKSDA: DS1.6(I/O) U5.196(PB7/TIM4_CH2/_I2C1_SDA/USART1_RX/FMC_NL/DCMI_VSYNC)
XFS_RST: C40.1 R24.2 U4.28(RESET)
ZDIAN: U5.61(PB0/TIM1_CH2N/TIM3_CH3/TIM8_CH2N/_LCD_R3/OTG_HS_ULPI_D1/ETH_MII_RXD2)
ZFENG: U5.44(PA1/ETH_MII_RX_CLK/ETH_RMII_REF_CLK/ADC123_IN1)
Net*R1_2: *R1.2 U5.33(PH1/OSC_OUT)
Net*R2_2: *R2.2 R57.2 U5.203(PDR_ON)
Net*R3_2: *R3.2 C47.1 R58.2 U5.6(VBAT)
NetBOOT_3: BOOT.3 R43.1
NetBOOT_4: BOOT.4 R42.2
NetBT1_1: BT1.1 D59.1
NetC1_2: C1.2 C2.2 R1.1 U2.12(VCC) U2.37(VCC)
NetC27_1: C27.1 L1.2 X1.1 X1.4(VCC)
NetC29_1: C29.1 R18.1 U6.4(-IN)
NetC29_2: C29.2 R19.2
NetC31_2: C31.2 U4.8(AO_P)
NetC33_1: C33.1 U6.2(BP) U6.3(+IN)
NetC35_1: C35.1 U4.11(VCM)
NetC41_2: C41.2 U5.9(PC14/OSC32_IN) Y2.1
NetC42_1: C42.1 U5.10(PC15/OSC32_OUT) Y2.2
NetC49_2: C49.2 U5.92(VCAP1)
NetC50_1: C50.1 U5.148(VCAP2)
NetC74_1: C74.1 D3.2(K) L3.1 U10.6(SW)
NetC74_2: C74.2 U10.1(BST)
NetC80_2: C80.2 U9.4(V3)
NetC81_2: C81.2 U9.7(XI) Y4.1(OSC1)
NetC82_2: C82.2 U9.8(XO) Y4.2(OSC2)
NetCD1_2: CD1.2 DS1.2(X1) Y1.2(OSC2)
NetCD2_2: CD2.2 DS1.3(X2) Y1.1(OSC1)
NetD1_1: D1.1(A) R21.1
NetD2_2: D2.2(K) L2.2 U11.2(out)
NetD4_2: D4.2 Q2.3(C) R41.2
NetFB1_1: FB1.1 P1.1
NetQ1_2: Q1.2(B) Q2.1(E) R39.2
NetQ1_3: Q1.3(C) R38.1
NetQ2_2: Q2.2(B) R40.2
NetR7_1: R7.1 U2.19(~{WP})
NetR20_2: R20.2 U4.3(RREF)
NetR22_1: R22.1 X1.3
NetR32_1: R32.1 R33.1 U11.4(feeddack)
NetR34_1: R34.1 U10.4(EN)
NetR35_1: R35.1 R36.2 R37.2 U10.3(FB)
NetR39_1: R39.1 U9.14(RTS#)
NetR40_1: R40.1 U9.13(DTR#)
NetU4_53: U4.53(A1) U4.54(A2)

Not connected (* = marked no-connect by the designer): *R1 1; DC1 3; J1 10(CD) 11(WP) 12(GND) 13(GND); U3 1(TP) 3(~{SLEEP}) 5(TP) 7(NC) 8(NC); U4 5(NC) 6(NC) 9(AO_N) 19(NC) 30(NC) 31(NC) 32(NC) 33(NC) 34(NC) 35(NC) 38(NC) 58(NC) 61(NC) 63(NC); U5 0 31(PF10/FMC_INTR/DCMI_D11/__LCD_DE) 47(PH3/ETH_MII_COL/FMC_SDNE0/_LCD_R1) 179(PG10/LCD_G3/_FMC_NCE4_1/FMC_NE3/DCMI_D2/_LCD_B2) 192(PB3/JTDO/TRACESWO/TIM2_CH2/SPI1_SCK/SPI3_SCK/I2S3_CK) 194(PB5/TIM3_CH2/I2C1_SMBA/SPI1_MOSI/SPI3_MOSI/I2S3_SD/CAN2_RX/OTG_HS_ULPI_D7/ETH_PPS_OUT/FMC_SDCKE1); U9 9(CTS#) 10(DSR#) 11(RI#) 12(DCD#) 15(R232); USB_1 4(NC)

## Notes on the sheet
- (near U1) SDRAM
- BOOT
- (near U2) NAND FLASH
- TFT LCD接口(RGB)
- (near R2) RESET
- X             0         主闪存存储器
- BOOT1   BOOT0   启动模式
- 0              1         系统存储器
- 1              1         内置SRAM
- RTC 外
- FPC-40P-0.5 翻盖插座
- 等长布线
- 内部看门狗
- 液晶数据缓存
- 3.3V参考电压（用于ADC）
- (near U8) EEPROM
- (near U7) SPI FLASH
- (near FB6) 模拟电压
- 3.3V参考
- (near U8) AT24C64是存储器容量为
- (near U8) AT24C02是一个2K位串行CMOS E
- (near U7) SPI FLASH 32M 字
- 存储配置数据等如温度校正值
- 存储日志,曲线等看情况使用
- (near U5) MCU
- 3.3V有源，主
- MCLK
- PRINTF
- (near WK1) TIM2 PWM
- (5mV/°C)温度1
- 风机调速 PWM
- 空，备用
- (near L1) 3.3V有源，主时钟倍频
- DEBUG
- (0~150mA)输出1
- (0~150mA)输出2
- (5mV/°C)温度2
- (5mV/°C)温度3
- 信号检测入
- EH12编码器
- EH12编码器  按钮
- TIM5编码器模式
- TIM3 PWM(暂不用,用调相方式)
- (0-3V)主电机调速 PWM
- TIM3 CH1 PWM 现不用定时器直接管脚
- TIM3 CH4 主电机速度回
- (near U5) EH12编码器 按钮
- (near U5) EH12编码器
- TIM8编码器模式
- TIM4 CH4 PWM 液晶背光
- 继电器1
- (near U5) 按键5
- (near U5) 按键6
- (near U5) 按键7
- 继电器2
- 继电器3
- 继电器4
- 继电器5
- 继电器6
- (5mV/°C)温度4
- 4-20Ma(0.6-3V)第一路
- 4-20Ma(0.6-3V)第二路
- RTC CLK
- USB串口，USB下载口
- 按键1
- 按键3
- 按键4
- 按键2
- TIM7 定时器内部计数
- 过零检测入
- (near *R2) 不贴
- (near R58) RTC VBAT
- 点火检测入
- 风机检测入
- (near *R3) 不贴
- 默认*R2不焊接,R55焊接
- R55焊接时,*R2不能焊接,
- 目前工作模式是读取片外时钟，设置片内时钟，所以片内RTC不需要断电保持。
- Labels drawn without touching a wire or pin: AC1_IN, BY1_IN, DH1_IN, DH2_IN, FMC_A18, FMC_NE1, GPIO2, GPIO16, IO1_IN, IO2_IN, IO3_IN, IO4_IN, IO5_IN, IO6_IN, JDQ1, JDQ2, JDQ3, JDQ4, JDQ5, JDQ6, LCD_B0, LCD_B1, LCD_B2, LCD_G0, LCD_G1, LED1, LED2, LED3, LED4, LED5, LED6, SD_DETECT, USART6_RX, USART6_TX, USB_UP, USBDM, USBDP
- (in symbol CAP POL) +